# EasyEDA Pro project TOLL四合一电调.epro, board 100V_四路_功率板_HYG
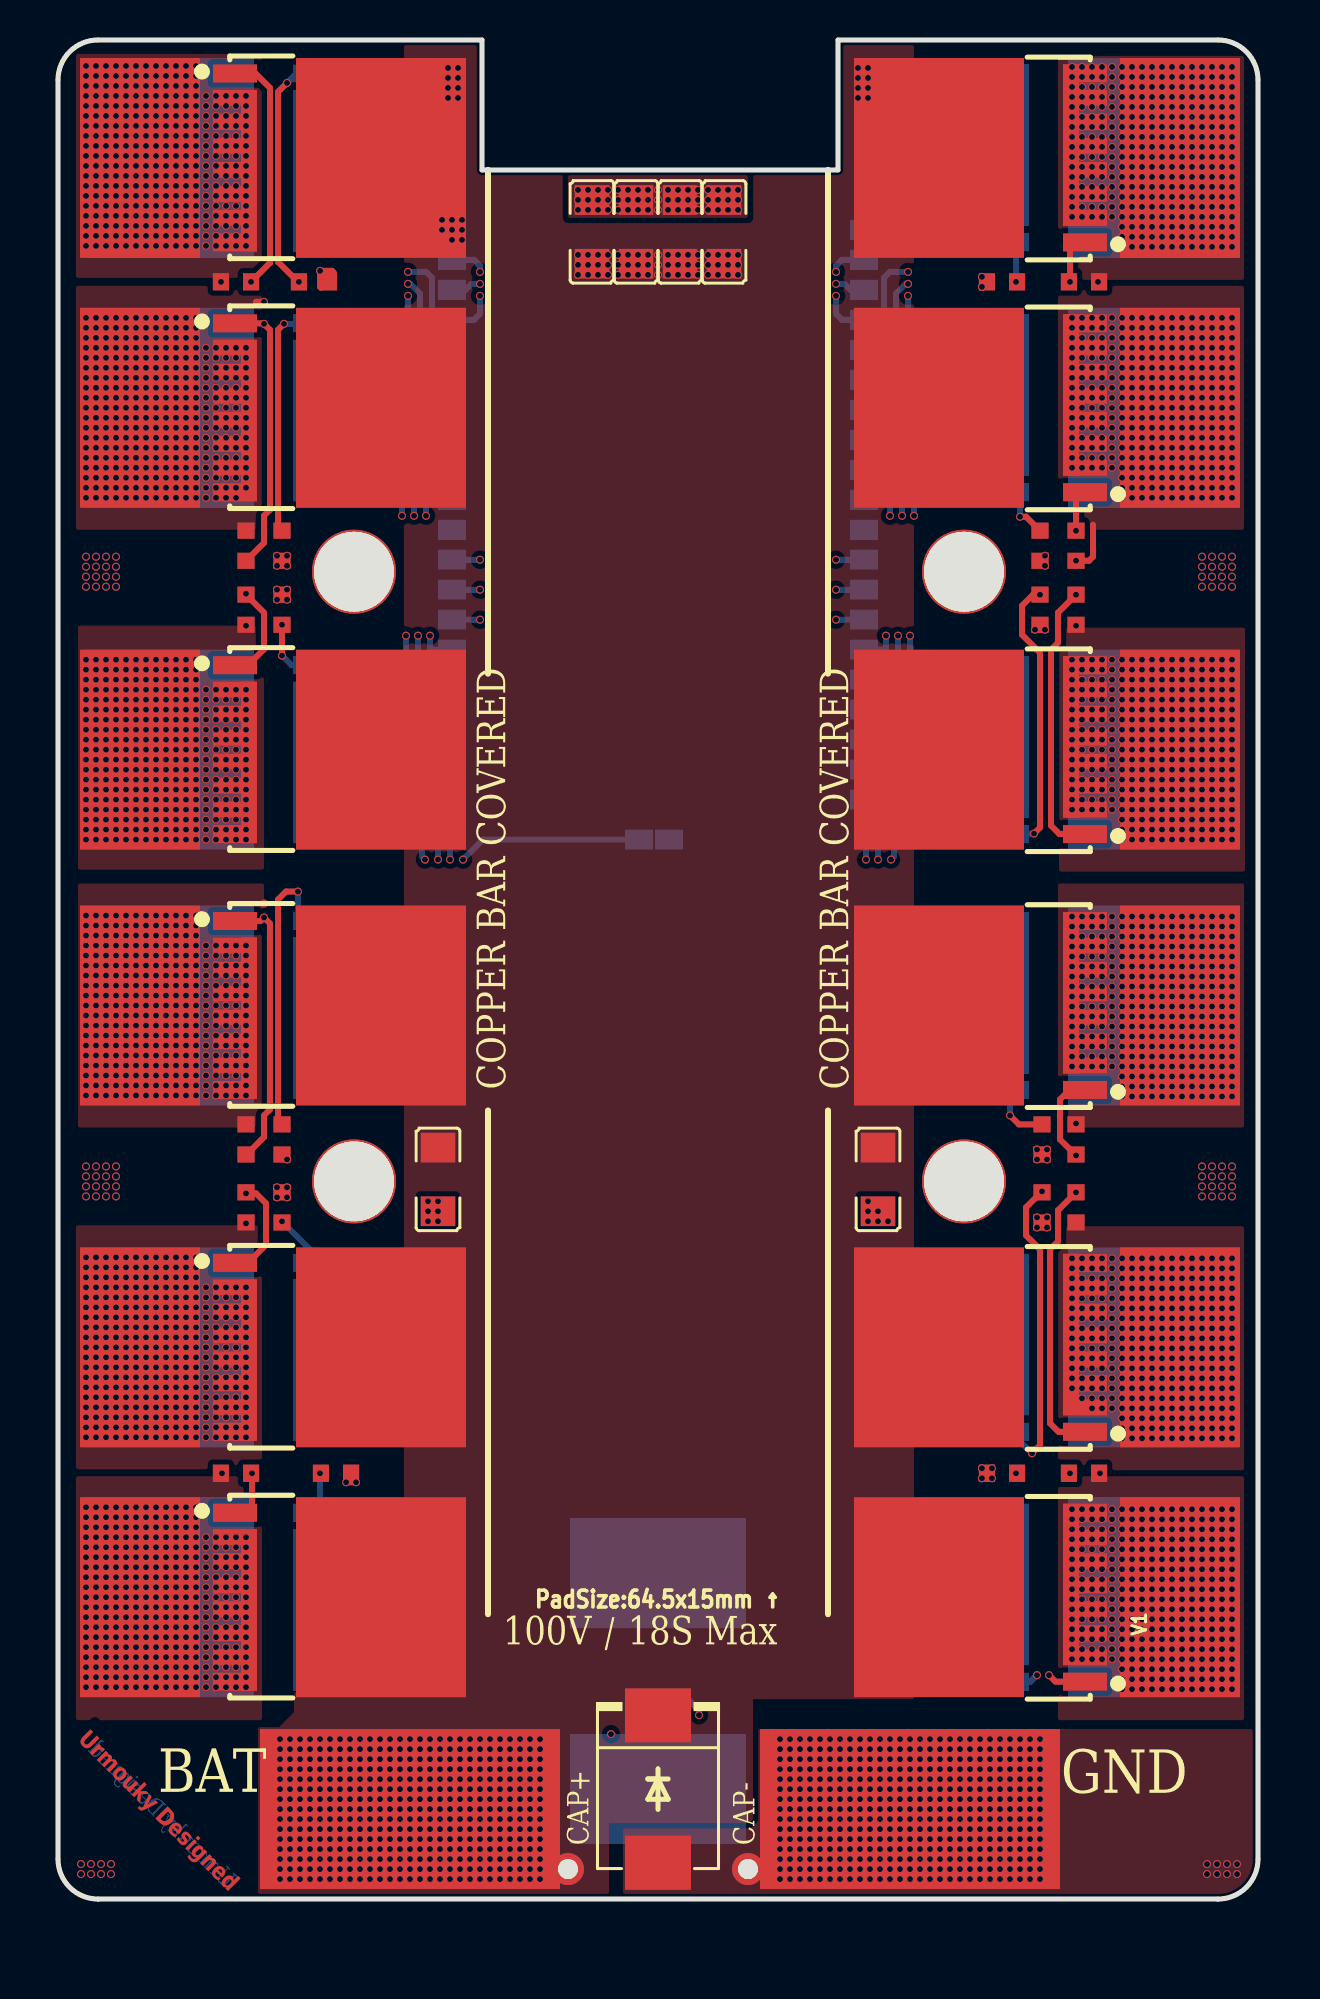
[diagram p1: board, top side]
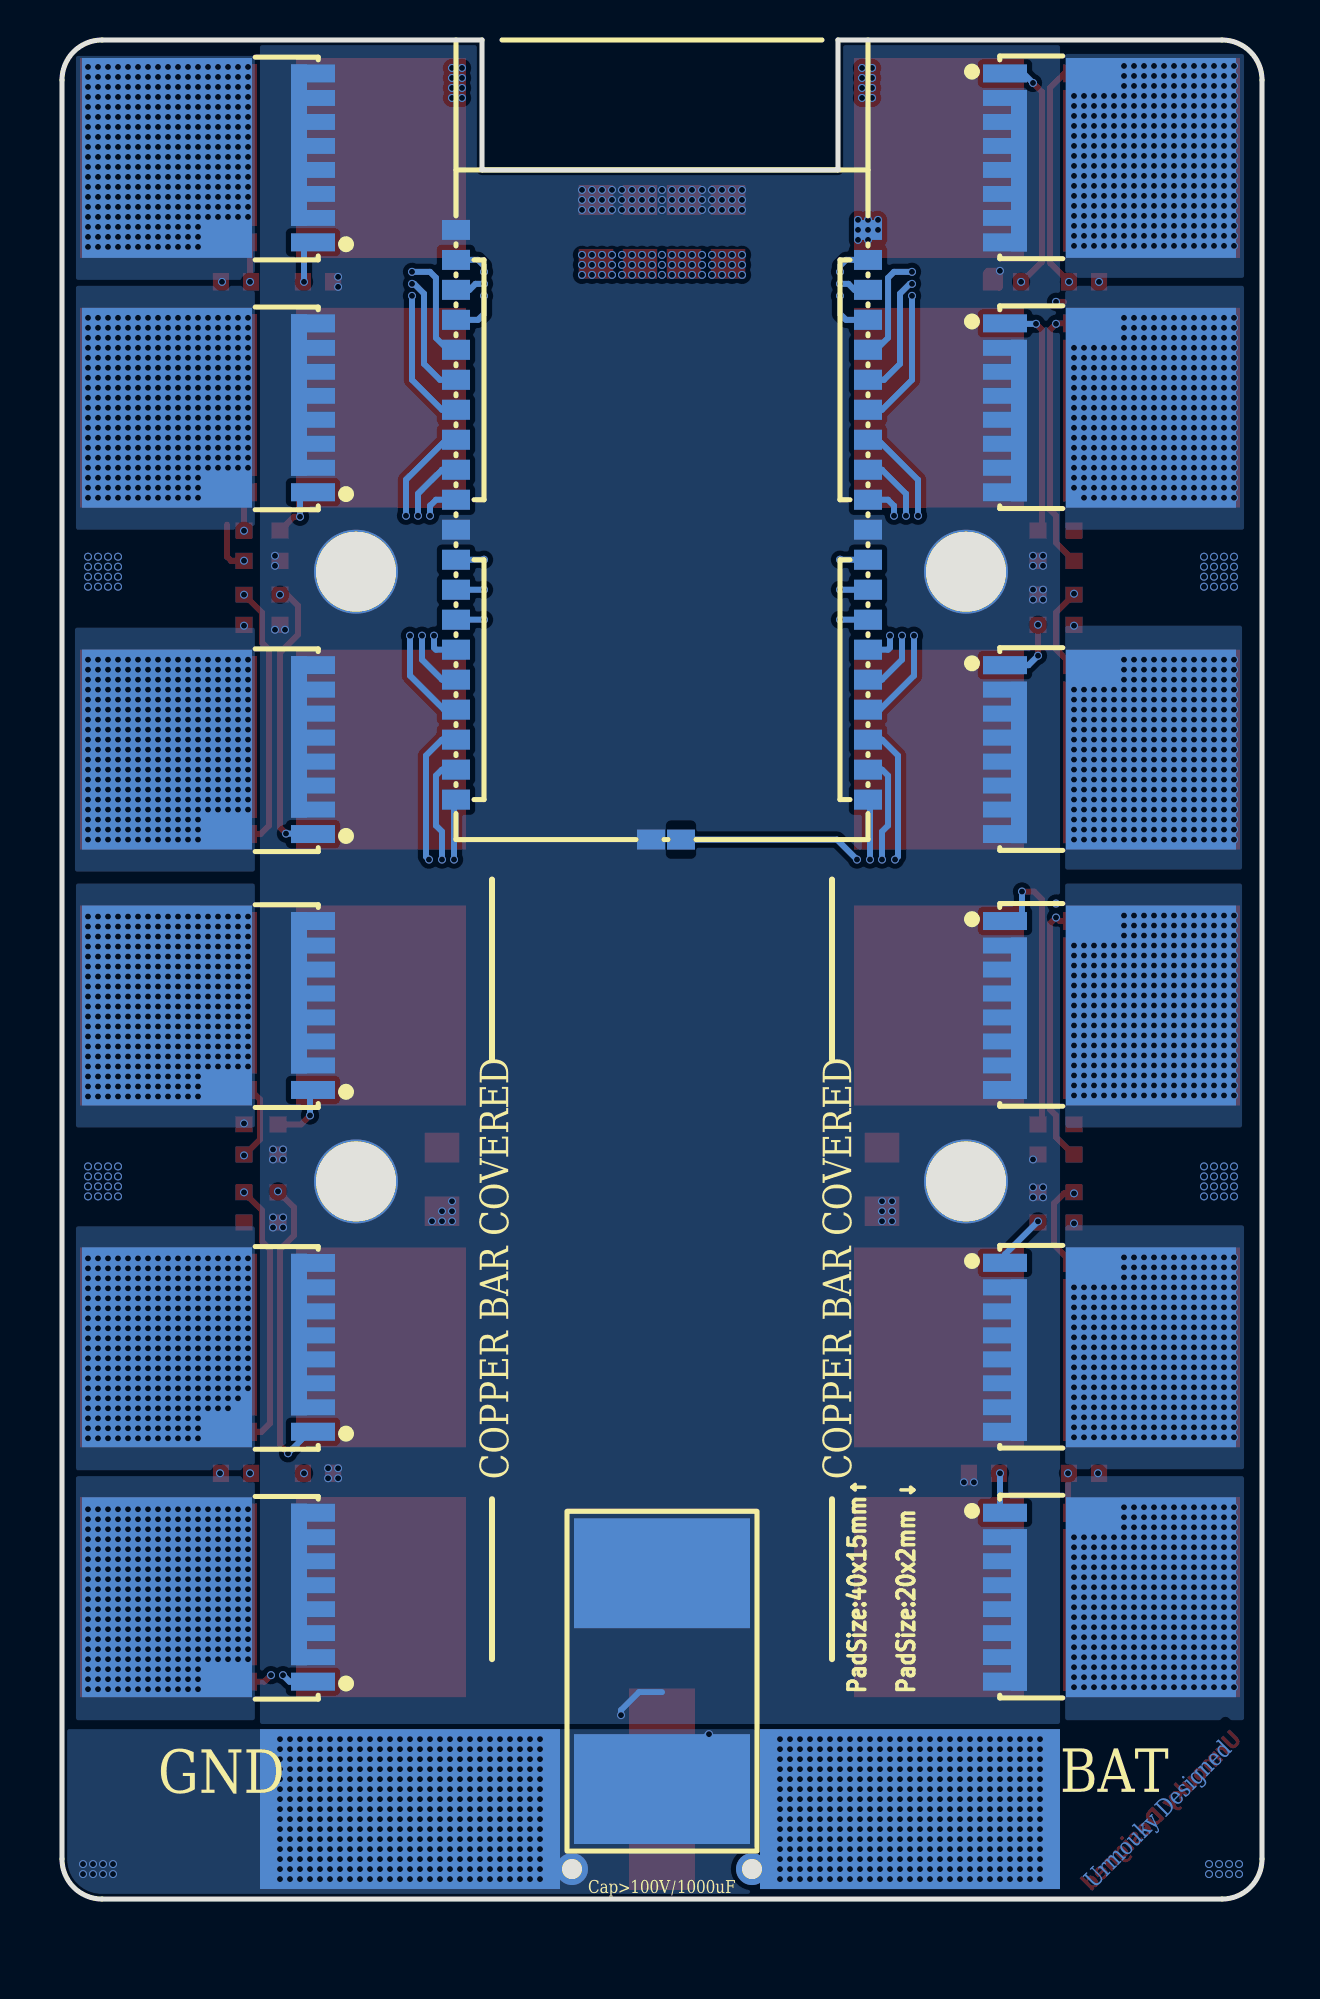
[diagram p2: board, bottom side, seen from below]

Outline 60 x 93 mm; copper layers: Top Layer, 过流源层, 隔离地层, 信号层, 过流地层, Bottom Layer. Coordinates in mm from the lower left corner of the outline.
Outline path: 0,91 arc(0.59,92.41) 2,93 21.2,93 21.2,86.5 39,86.5 39,93 58,93 arc(59.41,92.41) 60,91 60,2 arc(59.41,0.59) 58,0 2,0 arc(0.59,0.59) 0,2 0,91
Stack: Top Layer 0.035mm 外层铜厚1oz / Dielectric1 0.0994mm 3313 RC57% 4.2mil / 过流源层 0.0152mm 内层铜厚 / Dielectric2 0.55mm 0.55mm H/H No copper / 隔离地层 0.035mm / Dielectric3 0.1088mm 2116 RC54% 4.9mil / 信号层 0.035mm / Dielectric4 0.55mm 0.55mm H/H No copper / 过流地层 0.0152mm 内层铜厚 / Dielectric5 0.0994mm 3313 RC57% 4.2mil / Bottom Layer 0.035mm 外层铜厚1oz

## Design rules (mm)
template: 自定义配置
spacing copperThickness1oz (default): track to track 0.102, other pairs 0.152 to 0.3
spacing copperThickness2oz: track to track 0.203, other pairs 0.152 to 0.3
track width copperThickness1oz (default): min 0.127, default 0.254, max 2.54
track width copperThickness2oz: min 0.203, default 0.254, max 2.54
differential pair differentialPair (default): width min 0.127, default 0.254, max 2.54; gap min 0.152, default 0.152
via viaSize (default): diameter min 0.4, default 0.4, max 10; hole min 0.3, default 0.3, max 6.3

## Placement (name value [footprint] x y rotation side)
BAT  -  [焊盘3*4mm#2]  17.6 4.5 0 top
BAT1  -  [焊盘3*4mm#2]  17.6 4.5 180 bottom
Board1  -  [AT32四合一电调控制板]  30 73 180 bottom
C2  10uF  [C1206]  26.7 83.4 270 top
C3  10uF  [C1206]  19 36 90 top
C4  10uF  [C1206]  28.9 83.4 270 top
C5  10uF  [C1206]  31.1 83.4 270 top
C6  10uF  [C1206]  33.3 83.4 270 top
C7  10uF  [C1206]  41 36 90 top
D2  SMDJ90A  [SMC_L6.9-W5.9-LS8.0-RD]  30 5.5 270 top
GND  -  [焊盘3*4mm#2]  42.6 4.5 0 top
GND1  -  [焊盘3*4mm#2]  42.6 4.5 180 bottom
NOREF  -  [Pad_e244]  14.8 66.4 0 top
NOREF#2  -  [Pad_e19]  25.5 1.5 0 top
NOREF#3  -  [Pad_e248]  45.3 35.9 0 top
NOREF#4  -  [Pad_e18]  34.5 1.5 0 top
NOREF#5  -  [Pad_e246]  45.3 66.4 0 top
NOREF#6  -  [Pad_e247]  14.8 35.9 0 top
Q1  HYG015N10NS1TA  [TOLL-8_L10.4-W9.9-P1.20-LS11.7-BL]  47.7 27.6 90 top
Q2  HYG015N10NS1TA  [TOLL-8_L10.4-W9.9-P1.20-LS11.7-BL]  47.7 15.1 90 top
Q3  HYG015N10NS1TA  [TOLL-8_L10.4-W9.9-P1.20-LS11.7-BL]  47.7 44.7 90 top
Q4  HYG015N10NS1TA  [TOLL-8_L10.4-W9.9-P1.20-LS11.7-BL]  51.1 27.6 90 bottom
Q5  HYG015N10NS1TA  [TOLL-8_L10.4-W9.9-P1.20-LS11.7-BL]  51.1 15.1 90 bottom
Q6  HYG015N10NS1TA  [TOLL-8_L10.4-W9.9-P1.20-LS11.7-BL]  51.1 44.7 90 bottom
Q7  HYG015N10NS1TA  [TOLL-8_L10.4-W9.9-P1.20-LS11.7-BL]  47.7 57.5 90 top
Q8  HYG015N10NS1TA  [TOLL-8_L10.4-W9.9-P1.20-LS11.7-BL]  47.7 74.6 90 top
Q9  HYG015N10NS1TA  [TOLL-8_L10.4-W9.9-P1.20-LS11.7-BL]  47.7 87.1 90 top
Q10  HYG015N10NS1TA  [TOLL-8_L10.4-W9.9-P1.20-LS11.7-BL]  51.1 57.5 90 bottom
Q11  HYG015N10NS1TA  [TOLL-8_L10.4-W9.9-P1.20-LS11.7-BL]  51.1 74.6 90 bottom
Q12  HYG015N10NS1TA  [TOLL-8_L10.4-W9.9-P1.20-LS11.7-BL]  51.1 87.1 90 bottom
Q13  HYG015N10NS1TA  [TOLL-8_L10.4-W9.9-P1.20-LS11.7-BL]  12.5 44.7 270 top
Q14  HYG015N10NS1TA  [TOLL-8_L10.4-W9.9-P1.20-LS11.7-BL]  12.5 27.6 270 top
Q15  HYG015N10NS1TA  [TOLL-8_L10.4-W9.9-P1.20-LS11.7-BL]  12.5 15.1 270 top
Q16  HYG015N10NS1TA  [TOLL-8_L10.4-W9.9-P1.20-LS11.7-BL]  9.2 44.7 270 bottom
Q17  HYG015N10NS1TA  [TOLL-8_L10.4-W9.9-P1.20-LS11.7-BL]  9.2 27.6 270 bottom
Q18  HYG015N10NS1TA  [TOLL-8_L10.4-W9.9-P1.20-LS11.7-BL]  9.2 15.1 270 bottom
Q19  HYG015N10NS1TA  [TOLL-8_L10.4-W9.9-P1.20-LS11.7-BL]  12.5 87.1 270 top
Q20  HYG015N10NS1TA  [TOLL-8_L10.4-W9.9-P1.20-LS11.7-BL]  12.5 74.6 270 top
Q21  HYG015N10NS1TA  [TOLL-8_L10.4-W9.9-P1.20-LS11.7-BL]  12.5 57.5 270 top
Q22  HYG015N10NS1TA  [TOLL-8_L10.4-W9.9-P1.20-LS11.7-BL]  9.2 87.1 270 bottom
Q23  HYG015N10NS1TA  [TOLL-8_L10.4-W9.9-P1.20-LS11.7-BL]  9.2 74.6 270 bottom
Q24  HYG015N10NS1TA  [TOLL-8_L10.4-W9.9-P1.20-LS11.7-BL]  9.2 57.5 270 bottom
R1  10kΩ  [R0603]  50.9 34.6 270 top
R2  10kΩ  [R0603]  51.3 21.3 0 top
R3  10kΩ  [R0603]  50.9 38 90 top
R4  10kΩ  [R0603]  49.2 34.6 90 top
R5  10kΩ  [R0603]  47.2 21.3 0 top
R6  10kΩ  [R0603]  49.2 38 90 top
R7  10kΩ  [R0603]  50.9 64.5 270 top
R8  10kΩ  [R0603]  50.9 67.7 270 top
R9  10kΩ  [R0603]  51.3 80.9 0 top
R10  10kΩ  [R0603]  49.1 64.5 90 top
R11  10kΩ  [R0603]  49.1 67.7 90 top
R12  10kΩ  [R0603]  47.2 80.9 0 top
R13  10kΩ  [R0603]  9.4 38 90 top
R14  10kΩ  [R0603]  9.4 34.6 270 top
R15  10kΩ  [R0603]  8.9 21.3 180 top
R16  10kΩ  [R0603]  11.2 38 90 top
R17  10kΩ  [R0603]  11.2 34.6 270 top
R18  10kΩ  [R0603]  13.9 21.3 180 top
R19  10kΩ  [R0603]  8.9 80.9 180 top
R20  10kΩ  [R0603]  9.4 67.7 90 top
R21  10kΩ  [R0603]  9.4 64.5 270 top
R22  10kΩ  [R0603]  12.8 80.9 180 top
R23  10kΩ  [R0603]  11.2 67.7 90 top
R24  10kΩ  [R0603]  11.2 64.5 270 top
RSENS  0.2mΩ  [R5930]  30 10.9 90 bottom
U1  -  [焊盘3*4mm]  56.1 27.6 90 top
U2  -  [焊盘3*4mm]  56.1 57.5 90 top
U3  -  [焊盘3*4mm]  4.1 44.7 270 top
U4  -  [焊盘3*4mm]  4.1 87.1 270 top
V1  -  [焊盘3*4mm]  56.1 15.1 90 top
V2  -  [焊盘3*4mm]  56.1 74.6 90 top
V3  -  [焊盘3*4mm]  4.1 27.6 270 top
V4  -  [焊盘3*4mm]  4.1 74.6 270 top
W1  -  [焊盘3*4mm]  56.1 44.7 90 top
W2  -  [焊盘3*4mm]  56.1 87.1 90 top
W3  -  [焊盘3*4mm]  4.1 15.1 270 top
W4  -  [焊盘3*4mm]  4.1 57.5 270 top

## Footprints (pads in the part's own frame, mm; a bottom-side part is the same pattern mirrored in y, then rotated)
AT32四合一电调控制板
  custom 1.4x1 smd: 1(-10.3,10.5) 2(-10.3,9) 3(-10.3,7.5) 4(-10.3,6) 5(-10.3,4.5) 6(-10.3,3) 7(-10.3,1.5) 8(-10.3,0) 9(-10.3,-1.5) 10(-10.3,-3) 11(-10.3,-4.5) 12(-10.3,-6) 13(-10.3,-7.5) 14(-10.3,-9) 15(-10.3,-10.5) 16(-10.3,-12) 17(-10.3,-13.5) 18(-10.3,-15) 19(-10.3,-16.5) 20(-10.3,-18) 21(10.3,-18) 22(10.3,-16.5) 23(10.3,-15) 24(10.3,-13.5) 25(10.3,-12) 26(10.3,-10.5) 27(10.3,-9) 28(10.3,-7.5) 29(10.3,-6) 30(10.3,-4.5) 31(10.3,-3) 32(10.3,-1.5) 33(10.3,0) 34(10.3,1.5) 35(10.3,3) 36(10.3,4.5) 37(10.3,6) 38(10.3,7.5) 39(10.3,9) 40(10.3,10.5) 41(0.95,-20) 42(-0.55,-20)
C1206
  rect 1.485x1.728 smd: 1(-1.593,0) 2(1.593,0)
Pad_e18
  round 1.6 hole 1: 1(0,0)
Pad_e19
  round 1.6 hole 1: 1(0,0)
Pad_e244
  round 4.2 hole 4: 1(0,0)
Pad_e246
  round 4.2 hole 4: 1(0,0)
Pad_e247
  round 4.2 hole 4: 1(0,0)
Pad_e248
  round 4.2 hole 4: 1(0,0)
R0603
  rect 0.806x0.864 smd: 1(-0.753,0) 2(0.753,0)
R5930
  rect 5.5x8.8 smd: 1(-5.4,0) 2(5.4,0)
SMC_L6.9-W5.9-LS8.0-RD
  rect 2.7x3.3 smd: 1(-3.687,0) 2(3.687,0)
TOLL-8_L10.4-W9.9-P1.20-LS11.7-BL
  rect 0.9x2.2 smd: 1(-4.225,-3.65) 8(4.225,-3.65)
  rect 0.8x2.2 smd: 2(-3,-3.65) 3(-1.8,-3.65) 4(-0.6,-3.65) 5(0.6,-3.65) 6(1.8,-3.65) 7(3,-3.65)
  rect 8.08x0.8 smd: 8(0.64,-2.95)
  rect 10x8.5 smd: 9(0,3.65)
焊盘3*4mm
  rect 10x6 smd: 1(0,0)
焊盘3*4mm#2
  rect 15x8 smd: 1(0,0)

## Nets
As in the schematic, except:
GND: Board1.1 Board1.11 Board1.30 Board1.42 C2.1 C3.1 C4.1 C5.1 C6.1 C7.1 NOREF.1 NOREF#3.1 NOREF#5.1 NOREF#6.1 Q4.2 Q4.3 Q4.4 Q4.5 Q4.6 Q4.7 Q4.8 Q5.2 Q5.3 Q5.4 Q5.5 Q5.6 Q5.7 Q5.8 Q6.2 Q6.3 Q6.4 Q6.5 Q6.6 Q6.7 Q6.8 Q10.2 Q10.3 Q10.4 Q10.5 Q10.6 Q10.7 Q10.8 Q11.2 Q11.3 Q11.4 Q11.5 Q11.6 Q11.7 Q11.8 Q12.2 Q12.3 Q12.4 Q12.5 Q12.6 Q12.7 Q12.8 Q16.2 Q16.3 Q16.4 Q16.5 Q16.6 Q16.7 Q16.8 Q17.2 Q17.3 Q17.4 Q17.5 Q17.6 Q17.7 Q17.8 Q18.2 Q18.3 Q18.4 Q18.5 Q18.6 Q18.7 Q18.8 Q22.2 Q22.3 Q22.4 Q22.5 Q22.6 Q22.7 Q22.8 Q23.2 Q23.3 Q23.4 Q23.5 Q23.6 Q23.7 Q23.8 Q24.2 Q24.3 Q24.4 Q24.5 Q24.6 Q24.7 Q24.8 R4.1 R5.1 R6.1 R10.1 R11.1 R12.1 R16.1 R17.1 R18.1 R22.1 R23.1 R24.1 RSENS.2
GND_PORT: Board1.41 D2.2 GND.1 GND1.1 NOREF#4.1 RSENS.1
VIN_BOARD: BAT.1 BAT1.1 Board1.40 C2.2 C3.2 C4.2 C5.2 C6.2 C7.2 D2.1 NOREF#2.1 Q1.9 Q2.9 Q3.9 Q7.9 Q8.9 Q9.9 Q13.9 Q14.9 Q15.9 Q19.9 Q20.9 Q21.9

## Via types
v1: diameter 0.4, hole 0.3, Top Layer to Bottom Layer, 4834 vias

## Routing (per net, layer and track width the routed paths; a pad name or vN(x,y) marks a point on that pad's centre or on a via; arc(x,y) is an arc through that point)
GND: length 4.8
  Top Layer w0.3: v1(14.9,20.85) v1(14.4,20.85) ; 13.15,80.6 13.1,80.65 v1(13.1,81.45) 13.7,81.45 13.8,81.35
  Bottom Layer w0.3: 30,10.35 31.15,10.35 32.05,9.45 v1(32.05,9.2)
  vias: v1(1.15,1.75) v1(1.15,1.25) v1(1.4,67.15) v1(1.4,66.65) v1(1.4,66.15) v1(1.4,65.65) v1(1.4,36.65) v1(1.4,36.15) v1(1.4,35.65) v1(1.4,35.15) v1(1.65,1.75) v1(1.65,1.25) v1(1.9,67.15) v1(1.9,66.65) v1(1.9,66.15) v1(1.9,65.65) v1(1.9,36.65) v1(1.9,36.15) v1(1.9,35.65) v1(1.9,35.15) v1(2.15,1.75) v1(2.15,1.25) v1(2.4,67.15) v1(2.4,66.65) v1(2.4,66.15) v1(2.4,65.65) v1(2.4,36.65) v1(2.4,36.15) v1(2.4,35.65) v1(2.4,35.15) v1(2.65,1.75) v1(2.65,1.25) v1(2.9,67.15) v1(2.9,66.65) v1(2.9,66.15) v1(2.9,65.65) v1(2.9,36.65) v1(2.9,36.15) v1(2.9,35.65) v1(2.9,35.15) v1(10.95,67.2) v1(10.95,66.7) v1(10.95,65.5) v1(10.95,65) v1(10.95,35.6) v1(10.95,35.1) v1(11.45,67.2) v1(11.45,66.7) v1(11.45,65.5) v1(11.45,65) v1(11.45,37) v1(11.45,35.6) v1(11.45,35.1) v1(18.5,34.91) v1(18.5,34.41) v1(18.5,33.91) v1(19,34.91) v1(19,34.41) v1(19,33.91) v1(26,85.5) v1(26,85) v1(26,84.5) v1(26.5,85.5) v1(26.5,85) v1(26.5,84.5) v1(27,85.5) v1(27,85) v1(27,84.5) v1(27.5,85.5) v1(27.5,85) v1(27.5,84.5) v1(28,85.5) v1(28,85) v1(28,84.5) v1(28.5,85.5) v1(28.5,85) v1(28.5,84.5) v1(29,85.5) v1(29,85) v1(29,84.5) v1(29.5,85.5) v1(29.5,85) v1(29.5,84.5) v1(30,85.5) v1(30,85) v1(30,84.5) v1(30.5,85.5) v1(30.5,85) v1(30.5,84.5) v1(31,85.5) v1(31,85) v1(31,84.5) v1(31.5,85.5) v1(31.5,85) v1(31.5,84.5) v1(32,85.5) v1(32,85) v1(32,84.5) v1(32.5,85.5) v1(32.5,85) v1(32.5,84.5) v1(33,85.5) v1(33,85) v1(33,84.5) v1(33.5,85.5) v1(33.5,85) v1(33.5,84.5) v1(34,85.5) v1(34,85) v1(34,84.5) v1(40.5,34.91) v1(40.5,34.41) v1(40.5,33.91) v1(41,34.41) v1(41,33.91) v1(41.5,33.91) v1(46.2,81.15) v1(46.2,80.65) v1(46.2,21.55) v1(46.2,21.05) v1(46.7,21.55) v1(46.7,21.05) v1(48.85,63.5) v1(48.95,37.5) v1(48.95,37) v1(48.95,34.1) v1(48.95,33.6) v1(49.35,67.2) v1(49.35,66.7) v1(49.35,63.5) v1(49.45,37.5) v1(49.45,37) v1(49.45,34.1) v1(49.45,33.6) v1(57.2,67.15) v1(57.2,66.65) v1(57.2,66.15) v1(57.2,65.65) v1(57.2,36.65) v1(57.2,36.15) v1(57.2,35.65) v1(57.2,35.15) v1(57.7,67.15) v1(57.7,66.65) v1(57.7,66.15) v1(57.7,65.65) v1(57.7,36.65) v1(57.7,36.15) v1(57.7,35.65) v1(57.7,35.15) v1(58.2,67.15) v1(58.2,66.65) v1(58.2,66.15) v1(58.2,65.65) v1(58.2,36.65) v1(58.2,36.15) v1(58.2,35.65) v1(58.2,35.15) v1(58.7,67.15) v1(58.7,66.65) v1(58.7,66.15) v1(58.7,65.65) v1(58.7,36.65) v1(58.7,36.15) v1(58.7,35.65) v1(58.7,35.15)
GND_PORT: length 62.2
  信号层 w0.3: v1(20.25,52) 20.25,9.95 21.35,8.85 27.05,8.85 v1(27.65,8.25)
  Bottom Layer w0.3: v1(27.65,8.25) 27.7,8.25 28.8,7.15 30,7.15 ; v1(20.25,52) 21.25,53 Board1.41
  vias: v1(36.1,8) v1(36.1,7.5) v1(36.1,7) v1(36.1,6.5) v1(36.1,6) v1(36.1,5.5) v1(36.1,5) v1(36.1,4.5) v1(36.1,4) v1(36.1,3.5) v1(36.1,3) v1(36.1,2.5) v1(36.1,2) v1(36.1,1.5) v1(36.1,1) v1(36.6,8) v1(36.6,7.5) v1(36.6,7) v1(36.6,6.5) v1(36.6,6) v1(36.6,5.5) v1(36.6,5) v1(36.6,4.5) v1(36.6,4) v1(36.6,3.5) v1(36.6,3) v1(36.6,2.5) v1(36.6,2) v1(36.6,1.5) v1(36.6,1) v1(37.1,8) v1(37.1,7.5) v1(37.1,7) v1(37.1,6.5) v1(37.1,6) v1(37.1,5.5) v1(37.1,5) v1(37.1,4.5) v1(37.1,4) v1(37.1,3.5) v1(37.1,3) v1(37.1,2.5) v1(37.1,2) v1(37.1,1.5) v1(37.1,1) v1(37.6,8) v1(37.6,7.5) v1(37.6,7) v1(37.6,6.5) v1(37.6,6) v1(37.6,5.5) v1(37.6,5) v1(37.6,4.5) v1(37.6,4) v1(37.6,3.5) v1(37.6,3) v1(37.6,2.5) v1(37.6,2) v1(37.6,1.5) v1(37.6,1) v1(38.1,8) v1(38.1,7.5) v1(38.1,7) v1(38.1,6.5) v1(38.1,6) v1(38.1,5.5) v1(38.1,5) v1(38.1,4.5) v1(38.1,4) v1(38.1,3.5) v1(38.1,3) v1(38.1,2.5) v1(38.1,2) v1(38.1,1.5) v1(38.1,1) v1(38.6,8) v1(38.6,7.5) v1(38.6,7) v1(38.6,6.5) v1(38.6,6) v1(38.6,5.5) v1(38.6,5) v1(38.6,4.5) v1(38.6,4) v1(38.6,3.5) v1(38.6,3) v1(38.6,2.5) v1(38.6,2) v1(38.6,1.5) v1(38.6,1) v1(39.1,8) v1(39.1,7.5) v1(39.1,7) v1(39.1,6.5) v1(39.1,6) v1(39.1,5.5) v1(39.1,5) v1(39.1,4.5) v1(39.1,4) v1(39.1,3.5) v1(39.1,3) v1(39.1,2.5) v1(39.1,2) v1(39.1,1.5) v1(39.1,1) v1(39.6,8) v1(39.6,7.5) v1(39.6,7) v1(39.6,6.5) v1(39.6,6) v1(39.6,5.5) v1(39.6,5) v1(39.6,4.5) v1(39.6,4) v1(39.6,3.5) v1(39.6,3) v1(39.6,2.5) v1(39.6,2) v1(39.6,1.5) v1(39.6,1) v1(40.1,8) v1(40.1,7.5) v1(40.1,7) v1(40.1,6.5) v1(40.1,6) v1(40.1,5.5) v1(40.1,5) v1(40.1,4.5) v1(40.1,4) v1(40.1,3.5) v1(40.1,3) v1(40.1,2.5) v1(40.1,2) v1(40.1,1.5) v1(40.1,1) v1(40.6,8) v1(40.6,7.5) v1(40.6,7) v1(40.6,6.5) v1(40.6,6) v1(40.6,5.5) v1(40.6,5) v1(40.6,4.5) v1(40.6,4) v1(40.6,3.5) v1(40.6,3) v1(40.6,2.5) v1(40.6,2) v1(40.6,1.5) v1(40.6,1) v1(41.1,8) v1(41.1,7.5) v1(41.1,7) v1(41.1,6.5) v1(41.1,6) v1(41.1,5.5) v1(41.1,5) v1(41.1,4.5) v1(41.1,4) v1(41.1,3.5) v1(41.1,3) v1(41.1,2.5) v1(41.1,2) v1(41.1,1.5) v1(41.1,1) v1(41.6,8) v1(41.6,7.5) v1(41.6,7) v1(41.6,6.5) v1(41.6,6) v1(41.6,5.5) v1(41.6,5) v1(41.6,4.5) v1(41.6,4) v1(41.6,3.5) v1(41.6,3) v1(41.6,2.5) v1(41.6,2) v1(41.6,1.5) v1(41.6,1) v1(42.1,8) v1(42.1,7.5) v1(42.1,7) v1(42.1,6.5) v1(42.1,6) v1(42.1,5.5) v1(42.1,5) v1(42.1,4.5) v1(42.1,4) v1(42.1,3.5) v1(42.1,3) v1(42.1,2.5) v1(42.1,2) v1(42.1,1.5) v1(42.1,1) v1(42.6,8) v1(42.6,7.5) v1(42.6,7) v1(42.6,6.5) v1(42.6,6) v1(42.6,5.5) v1(42.6,5) v1(42.6,4.5) v1(42.6,4) v1(42.6,3.5) v1(42.6,3) v1(42.6,2.5) v1(42.6,2) v1(42.6,1.5) v1(42.6,1) v1(43.1,8) v1(43.1,7.5) v1(43.1,7) v1(43.1,6.5) v1(43.1,6) v1(43.1,5.5) v1(43.1,5) v1(43.1,4.5) v1(43.1,4) v1(43.1,3.5) v1(43.1,3) v1(43.1,2.5) v1(43.1,2) v1(43.1,1.5) v1(43.1,1) v1(43.6,8) v1(43.6,7.5) v1(43.6,7) v1(43.6,6.5) v1(43.6,6) v1(43.6,5.5) v1(43.6,5) v1(43.6,4.5) v1(43.6,4) v1(43.6,3.5) v1(43.6,3) v1(43.6,2.5) v1(43.6,2) v1(43.6,1.5) v1(43.6,1) v1(44.1,8) v1(44.1,7.5) v1(44.1,7) v1(44.1,6.5) v1(44.1,6) v1(44.1,5.5) v1(44.1,5) v1(44.1,4.5) v1(44.1,4) v1(44.1,3.5) v1(44.1,3) v1(44.1,2.5) v1(44.1,2) v1(44.1,1.5) v1(44.1,1) v1(44.6,8) v1(44.6,7.5) v1(44.6,7) v1(44.6,6.5) v1(44.6,6) v1(44.6,5.5) v1(44.6,5) v1(44.6,4.5) v1(44.6,4) v1(44.6,3.5) v1(44.6,3) v1(44.6,2.5) v1(44.6,2) v1(44.6,1.5) v1(44.6,1) v1(45.1,8) v1(45.1,7.5) v1(45.1,7) v1(45.1,6.5) v1(45.1,6) v1(45.1,5.5) v1(45.1,5) v1(45.1,4.5) v1(45.1,4) v1(45.1,3.5) v1(45.1,3) v1(45.1,2.5) v1(45.1,2) v1(45.1,1.5) v1(45.1,1) v1(45.6,8) v1(45.6,7.5) v1(45.6,7) v1(45.6,6.5) v1(45.6,6) v1(45.6,5.5) v1(45.6,5) v1(45.6,4.5) v1(45.6,4) v1(45.6,3.5) v1(45.6,3) v1(45.6,2.5) v1(45.6,2) v1(45.6,1.5) v1(45.6,1) v1(46.1,8) v1(46.1,7.5) v1(46.1,7) v1(46.1,6.5) v1(46.1,6) v1(46.1,5.5) v1(46.1,5) v1(46.1,4.5) v1(46.1,4) v1(46.1,3.5) v1(46.1,3) v1(46.1,2.5) v1(46.1,2) v1(46.1,1.5) v1(46.1,1) v1(46.6,8) v1(46.6,7.5) v1(46.6,7) v1(46.6,6.5) v1(46.6,6) v1(46.6,5.5) v1(46.6,5) v1(46.6,4.5) v1(46.6,4) v1(46.6,3.5) v1(46.6,3) v1(46.6,2.5) v1(46.6,2) v1(46.6,1.5) v1(46.6,1) v1(47.1,8) v1(47.1,7.5) v1(47.1,7) v1(47.1,6.5) v1(47.1,6) v1(47.1,5.5) v1(47.1,5) v1(47.1,4.5) v1(47.1,4) v1(47.1,3.5) v1(47.1,3) v1(47.1,2.5) v1(47.1,2) v1(47.1,1.5) v1(47.1,1) v1(47.6,8) v1(47.6,7.5) v1(47.6,7) v1(47.6,6.5) v1(47.6,6) v1(47.6,5.5) v1(47.6,5) v1(47.6,4.5) v1(47.6,4) v1(47.6,3.5) v1(47.6,3) v1(47.6,2.5) v1(47.6,2) v1(47.6,1.5) v1(47.6,1) v1(48.1,8) v1(48.1,7.5) v1(48.1,7) v1(48.1,6.5) v1(48.1,6) v1(48.1,5.5) v1(48.1,5) v1(48.1,4.5) v1(48.1,4) v1(48.1,3.5) v1(48.1,3) v1(48.1,2.5) v1(48.1,2) v1(48.1,1.5) v1(48.1,1) v1(48.6,8) v1(48.6,7.5) v1(48.6,7) v1(48.6,6.5) v1(48.6,6) v1(48.6,5.5) v1(48.6,5) v1(48.6,4.5) v1(48.6,4) v1(48.6,3.5) v1(48.6,3) v1(48.6,2.5) v1(48.6,2) v1(48.6,1.5) v1(48.6,1) v1(49.1,8) v1(49.1,7.5) v1(49.1,7) v1(49.1,6.5) v1(49.1,6) v1(49.1,5.5) v1(49.1,5) v1(49.1,4.5) v1(49.1,4) v1(49.1,3.5) v1(49.1,3) v1(49.1,2.5) v1(49.1,2) v1(49.1,1.5) v1(49.1,1) v1(57.45,1.75) v1(57.45,1.25) v1(57.95,1.75) v1(57.95,1.25) v1(58.45,1.75) v1(58.45,1.25) v1(58.95,1.75) v1(58.95,1.25)
VIN_BOARD:
  vias: v1(11.1,8) v1(11.1,7.5) v1(11.1,7) v1(11.1,6.5) v1(11.1,6) v1(11.1,5.5) v1(11.1,5) v1(11.1,4.5) v1(11.1,4) v1(11.1,3.5) v1(11.1,3) v1(11.1,2.5) v1(11.1,2) v1(11.1,1.5) v1(11.1,1) v1(11.6,8) v1(11.6,7.5) v1(11.6,7) v1(11.6,6.5) v1(11.6,6) v1(11.6,5.5) v1(11.6,5) v1(11.6,4.5) v1(11.6,4) v1(11.6,3.5) v1(11.6,3) v1(11.6,2.5) v1(11.6,2) v1(11.6,1.5) v1(11.6,1) v1(12.1,8) v1(12.1,7.5) v1(12.1,7) v1(12.1,6.5) v1(12.1,6) v1(12.1,5.5) v1(12.1,5) v1(12.1,4.5) v1(12.1,4) v1(12.1,3.5) v1(12.1,3) v1(12.1,2.5) v1(12.1,2) v1(12.1,1.5) v1(12.1,1) v1(12.6,8) v1(12.6,7.5) v1(12.6,7) v1(12.6,6.5) v1(12.6,6) v1(12.6,5.5) v1(12.6,5) v1(12.6,4.5) v1(12.6,4) v1(12.6,3.5) v1(12.6,3) v1(12.6,2.5) v1(12.6,2) v1(12.6,1.5) v1(12.6,1) v1(13.1,8) v1(13.1,7.5) v1(13.1,7) v1(13.1,6.5) v1(13.1,6) v1(13.1,5.5) v1(13.1,5) v1(13.1,4.5) v1(13.1,4) v1(13.1,3.5) v1(13.1,3) v1(13.1,2.5) v1(13.1,2) v1(13.1,1.5) v1(13.1,1) v1(13.6,8) v1(13.6,7.5) v1(13.6,7) v1(13.6,6.5) v1(13.6,6) v1(13.6,5.5) v1(13.6,5) v1(13.6,4.5) v1(13.6,4) v1(13.6,3.5) v1(13.6,3) v1(13.6,2.5) v1(13.6,2) v1(13.6,1.5) v1(13.6,1) v1(14.1,8) v1(14.1,7.5) v1(14.1,7) v1(14.1,6.5) v1(14.1,6) v1(14.1,5.5) v1(14.1,5) v1(14.1,4.5) v1(14.1,4) v1(14.1,3.5) v1(14.1,3) v1(14.1,2.5) v1(14.1,2) v1(14.1,1.5) v1(14.1,1) v1(14.6,8) v1(14.6,7.5) v1(14.6,7) v1(14.6,6.5) v1(14.6,6) v1(14.6,5.5) v1(14.6,5) v1(14.6,4.5) v1(14.6,4) v1(14.6,3.5) v1(14.6,3) v1(14.6,2.5) v1(14.6,2) v1(14.6,1.5) v1(14.6,1) v1(15.1,8) v1(15.1,7.5) v1(15.1,7) v1(15.1,6.5) v1(15.1,6) v1(15.1,5.5) v1(15.1,5) v1(15.1,4.5) v1(15.1,4) v1(15.1,3.5) v1(15.1,3) v1(15.1,2.5) v1(15.1,2) v1(15.1,1.5) v1(15.1,1) v1(15.6,8) v1(15.6,7.5) v1(15.6,7) v1(15.6,6.5) v1(15.6,6) v1(15.6,5.5) v1(15.6,5) v1(15.6,4.5) v1(15.6,4) v1(15.6,3.5) v1(15.6,3) v1(15.6,2.5) v1(15.6,2) v1(15.6,1.5) v1(15.6,1) v1(16.1,8) v1(16.1,7.5) v1(16.1,7) v1(16.1,6.5) v1(16.1,6) v1(16.1,5.5) v1(16.1,5) v1(16.1,4.5) v1(16.1,4) v1(16.1,3.5) v1(16.1,3) v1(16.1,2.5) v1(16.1,2) v1(16.1,1.5) v1(16.1,1) v1(16.6,8) v1(16.6,7.5) v1(16.6,7) v1(16.6,6.5) v1(16.6,6) v1(16.6,5.5) v1(16.6,5) v1(16.6,4.5) v1(16.6,4) v1(16.6,3.5) v1(16.6,3) v1(16.6,2.5) v1(16.6,2) v1(16.6,1.5) v1(16.6,1) v1(17.1,8) v1(17.1,7.5) v1(17.1,7) v1(17.1,6.5) v1(17.1,6) v1(17.1,5.5) v1(17.1,5) v1(17.1,4.5) v1(17.1,4) v1(17.1,3.5) v1(17.1,3) v1(17.1,2.5) v1(17.1,2) v1(17.1,1.5) v1(17.1,1) v1(17.6,8) v1(17.6,7.5) v1(17.6,7) v1(17.6,6.5) v1(17.6,6) v1(17.6,5.5) v1(17.6,5) v1(17.6,4.5) v1(17.6,4) v1(17.6,3.5) v1(17.6,3) v1(17.6,2.5) v1(17.6,2) v1(17.6,1.5) v1(17.6,1) v1(18.1,8) v1(18.1,7.5) v1(18.1,7) v1(18.1,6.5) v1(18.1,6) v1(18.1,5.5) v1(18.1,5) v1(18.1,4.5) v1(18.1,4) v1(18.1,3.5) v1(18.1,3) v1(18.1,2.5) v1(18.1,2) v1(18.1,1.5) v1(18.1,1) v1(18.6,8) v1(18.6,7.5) v1(18.6,7) v1(18.6,6.5) v1(18.6,6) v1(18.6,5.5) v1(18.6,5) v1(18.6,4.5) v1(18.6,4) v1(18.6,3.5) v1(18.6,3) v1(18.6,2.5) v1(18.6,2) v1(18.6,1.5) v1(18.6,1) v1(19.1,8) v1(19.1,7.5) v1(19.1,7) v1(19.1,6.5) v1(19.1,6) v1(19.1,5.5) v1(19.1,5) v1(19.1,4.5) v1(19.1,4) v1(19.1,3.5) v1(19.1,3) v1(19.1,2.5) v1(19.1,2) v1(19.1,1.5) v1(19.1,1) v1(19.2,84) v1(19.2,83.5) v1(19.5,91.6) v1(19.5,91.1) v1(19.5,90.6) v1(19.5,90.1) v1(19.6,8) v1(19.6,7.5) v1(19.6,7) v1(19.6,6.5) v1(19.6,6) v1(19.6,5.5) v1(19.6,5) v1(19.6,4.5) v1(19.6,4) v1(19.6,3.5) v1(19.6,3) v1(19.6,2.5) v1(19.6,2) v1(19.6,1.5) v1(19.6,1) v1(19.7,84) v1(19.7,83.5) v1(19.7,83) v1(20,91.6) v1(20,91.1) v1(20,90.6) v1(20,90.1) v1(20.1,8) v1(20.1,7.5) v1(20.1,7) v1(20.1,6.5) v1(20.1,6) v1(20.1,5.5) v1(20.1,5) v1(20.1,4.5) v1(20.1,4) v1(20.1,3.5) v1(20.1,3) v1(20.1,2.5) v1(20.1,2) v1(20.1,1.5) v1(20.1,1) v1(20.2,84) v1(20.2,83.5) v1(20.2,83) v1(20.6,8) v1(20.6,7.5) v1(20.6,7) v1(20.6,6.5) v1(20.6,6) v1(20.6,5.5) v1(20.6,5) v1(20.6,4.5) v1(20.6,4) v1(20.6,3.5) v1(20.6,3) v1(20.6,2.5) v1(20.6,2) v1(20.6,1.5) v1(20.6,1) v1(21.1,8) v1(21.1,7.5) v1(21.1,7) v1(21.1,6.5) v1(21.1,6) v1(21.1,5.5) v1(21.1,5) v1(21.1,4.5) v1(21.1,4) v1(21.1,3.5) v1(21.1,3) v1(21.1,2.5) v1(21.1,2) v1(21.1,1.5) v1(21.1,1) v1(21.6,8) v1(21.6,7.5) v1(21.6,7) v1(21.6,6.5) v1(21.6,6) v1(21.6,5.5) v1(21.6,5) v1(21.6,4.5) v1(21.6,4) v1(21.6,3.5) v1(21.6,3) v1(21.6,2.5) v1(21.6,2) v1(21.6,1.5) v1(21.6,1) v1(22.1,8) v1(22.1,7.5) v1(22.1,7) v1(22.1,6.5) v1(22.1,6) v1(22.1,5.5) v1(22.1,5) v1(22.1,4.5) v1(22.1,4) v1(22.1,3.5) v1(22.1,3) v1(22.1,2.5) v1(22.1,2) v1(22.1,1.5) v1(22.1,1) v1(22.6,8) v1(22.6,7.5) v1(22.6,7) v1(22.6,6.5) v1(22.6,6) v1(22.6,5.5) v1(22.6,5) v1(22.6,4.5) v1(22.6,4) v1(22.6,3.5) v1(22.6,3) v1(22.6,2.5) v1(22.6,2) v1(22.6,1.5) v1(22.6,1) v1(23.1,8) v1(23.1,7.5) v1(23.1,7) v1(23.1,6.5) v1(23.1,6) v1(23.1,5.5) v1(23.1,5) v1(23.1,4.5) v1(23.1,4) v1(23.1,3.5) v1(23.1,3) v1(23.1,2.5) v1(23.1,2) v1(23.1,1.5) v1(23.1,1) v1(23.6,8) v1(23.6,7.5) v1(23.6,7) v1(23.6,6.5) v1(23.6,6) v1(23.6,5.5) v1(23.6,5) v1(23.6,4.5) v1(23.6,4) v1(23.6,3.5) v1(23.6,3) v1(23.6,2.5) v1(23.6,2) v1(23.6,1.5) v1(23.6,1) v1(24.1,8) v1(24.1,7.5) v1(24.1,7) v1(24.1,6.5) v1(24.1,6) v1(24.1,5.5) v1(24.1,5) v1(24.1,4.5) v1(24.1,4) v1(24.1,3.5) v1(24.1,3) v1(24.1,2.5) v1(24.1,2) v1(24.1,1.5) v1(24.1,1) v1(26,82.25) v1(26,81.75) v1(26,81.25) v1(26.5,82.25) v1(26.5,81.75) v1(26.5,81.25) v1(27,82.25) v1(27,81.75) v1(27,81.25) v1(27.5,82.25) v1(27.5,81.75) v1(27.5,81.25) v1(28,82.25) v1(28,81.75) v1(28,81.25) v1(28.5,82.25) v1(28.5,81.75) v1(28.5,81.25) v1(29,82.25) v1(29,81.75) v1(29,81.25) v1(29.5,82.25) v1(29.5,81.75) v1(29.5,81.25) v1(30,82.25) v1(30,81.75) v1(30,81.25) v1(30.5,82.25) v1(30.5,81.75) v1(30.5,81.25) v1(31,82.25) v1(31,81.75) v1(31,81.25) v1(31.5,82.25) v1(31.5,81.75) v1(31.5,81.25) v1(32,82.25) v1(32,81.75) v1(32,81.25) v1(32.5,82.25) v1(32.5,81.75) v1(32.5,81.25) v1(33,82.25) v1(33,81.75) v1(33,81.25) v1(33.5,82.25) v1(33.5,81.75) v1(33.5,81.25) v1(34,82.25) v1(34,81.75) v1(34,81.25) v1(40,91.6) v1(40,91.1) v1(40,90.6) v1(40,90.1) v1(40.5,91.6) v1(40.5,91.1) v1(40.5,90.6) v1(40.5,90.1)
M1GHU: length 47.1
  Top Layer w0.3: Q1.1 50.02,23.37 49.6,23.8 49.6,32.5 50,32.9 50,34.45 v1(50.9,35.35)
  信号层 w0.3: 50.9,35.3 50,35.3 49.3,34.6 48.3,34.6 47,33.3 44,33.3 41,36.3 v1(41,52)
  Bottom Layer w0.3: Board1.19 41,56.5 41.3,56.2 41.3,53.7 41,53.4 v1(41,52)
M1GHV: length 63.6
  Top Layer w0.3: v1(49.55,11.2) 49.87,10.88 Q2.1
  信号层 w0.3: v1(49.55,11.2) 49.55,20.25 v1(50.6,21.3) 39.2,32.7 39.2,53.3 42,56.1 v1(42,63.2)
  Bottom Layer w0.3: Board1.16 41,61 42,62 v1(42,63.2)
M1GHW: length 41.7
  Top Layer w0.3: v1(50.9,37.2) 50.1,38 50.1,40 50.58,40.47 Q3.1
  信号层 w0.3: v1(50.9,37.2) 50,38.1 47.9,38.1 47,39 47,59.51 41.01,65.5 v1(38.9,65.5)
  Bottom Layer w0.3: Board1.13 v1(38.9,65.5)
M1GLU: length 42.4
  Top Layer w0.3: v1(48.7,22.3) 49.1,22.7 49.1,32.5 48.4,33.2 48.4,34.6 v1(49.2,35.4)
  信号层 w0.3: v1(41.65,52) 41.65,43.45 49.2,35.9 v1(49.2,35.4)
  Bottom Layer w0.3: v1(41.65,52) 41.8,52.15 41.8,57.2 41,58 Board1.18 ; v1(48.7,22.3) 47.62,23.37 Q4.1
M1GLV: length 60.8
  信号层 w0.3: v1(41.4,63.2) 41.4,56.4 38.6,53.6 38.6,32.4 47.9,23.1 v1(47.9,21.3) 48.95,20.25 v1(48.95,11.2)
  Bottom Layer w0.3: Q5.1 48.62,10.88 v1(48.95,11.2) ; Board1.15 41.3,62.5 41.4,62.6 v1(41.4,63.2)
M1GLW: length 36.7
  Top Layer w0.3: R6.2 48.05,38.75 v1(47.6,39.2)
  信号层 w0.3: v1(38.9,67) Board1.12 47.6,59.7 v1(47.6,39.2)
  Bottom Layer w0.3: Board1.12 v1(38.9,67) ; Q6.1 47.6,40.32 v1(47.6,39.2)
M1OUTU: length 30.9
  信号层 w0.3: v1(40.4,52) 40.4,36.1 43.8,32.7 50.05,32.7 v1(50.7,32.05)
  Bottom Layer w0.3: v1(40.4,52) 40.4,54.9 Board1.20
  vias: v1(50.7,31.55) v1(50.7,31.05) v1(50.7,30.55) v1(50.7,30.05) v1(50.7,29.55) v1(50.7,29.05) v1(50.7,28.55) v1(50.7,28.05) v1(50.7,27.55) v1(50.7,27.05) v1(50.7,26.55) v1(50.7,26.05) v1(50.7,25.55) v1(51.2,32.05) v1(51.2,31.55) v1(51.2,31.05) v1(51.2,30.55) v1(51.2,30.05) v1(51.2,29.55) v1(51.2,29.05) v1(51.2,28.55) v1(51.2,28.05) v1(51.2,27.55) v1(51.2,27.05) v1(51.2,26.55) v1(51.2,26.05) v1(51.2,25.55) v1(51.2,25.05) v1(51.7,32.05) v1(51.7,31.55) v1(51.7,31.05) v1(51.7,30.55) v1(51.7,30.05) v1(51.7,29.55) v1(51.7,29.05) v1(51.7,28.55) v1(51.7,28.05) v1(51.7,27.55) v1(51.7,27.05) v1(51.7,26.55) v1(51.7,26.05) v1(51.7,25.55) v1(51.7,25.05) v1(51.7,24.55) v1(52.2,32.05) v1(52.2,31.55) v1(52.2,31.05) v1(52.2,30.55) v1(52.2,30.05) v1(52.2,29.55) v1(52.2,29.05) v1(52.2,28.55) v1(52.2,28.05) v1(52.2,27.55) v1(52.2,27.05) v1(52.2,26.55) v1(52.2,26.05) v1(52.2,25.55) v1(52.2,25.05) v1(52.2,24.55) v1(52.7,32.05) v1(52.7,31.55) v1(52.7,31.05) v1(52.7,30.55) v1(52.7,30.05) v1(52.7,29.55) v1(52.7,29.05) v1(52.7,28.55) v1(52.7,28.05) v1(52.7,27.55) v1(52.7,27.05) v1(52.7,26.55) v1(52.7,26.05) v1(52.7,25.55) v1(52.7,25.05) v1(52.7,24.55) v1(53.2,32.05) v1(53.2,31.55) v1(53.2,31.05) v1(53.2,30.55) v1(53.2,30.05) v1(53.2,29.55) v1(53.2,29.05) v1(53.2,28.55) v1(53.2,28.05) v1(53.2,27.55) v1(53.2,27.05) v1(53.2,26.55) v1(53.2,26.05) v1(53.2,25.55) v1(53.2,25.05) v1(53.2,24.55) v1(53.2,24.05) v1(53.2,23.55) v1(53.2,23.05) v1(53.7,32.05) v1(53.7,31.55) v1(53.7,31.05) v1(53.7,30.55) v1(53.7,30.05) v1(53.7,29.55) v1(53.7,29.05) v1(53.7,28.55) v1(53.7,28.05) v1(53.7,27.55) v1(53.7,27.05) v1(53.7,26.55) v1(53.7,26.05) v1(53.7,25.55) v1(53.7,25.05) v1(53.7,24.55) v1(53.7,24.05) v1(53.7,23.55) v1(53.7,23.05) v1(54.2,32.05) v1(54.2,31.55) v1(54.2,31.05) v1(54.2,30.55) v1(54.2,30.05) v1(54.2,29.55) v1(54.2,29.05) v1(54.2,28.55) v1(54.2,28.05) v1(54.2,27.55) v1(54.2,27.05) v1(54.2,26.55) v1(54.2,26.05) v1(54.2,25.55) v1(54.2,25.05) v1(54.2,24.55) v1(54.2,24.05) v1(54.2,23.55) v1(54.2,23.05) v1(54.7,32.05) v1(54.7,31.55) v1(54.7,31.05) v1(54.7,30.55) v1(54.7,30.05) v1(54.7,29.55) v1(54.7,29.05) v1(54.7,28.55) v1(54.7,28.05) v1(54.7,27.55) v1(54.7,27.05) v1(54.7,26.55) v1(54.7,26.05) v1(54.7,25.55) v1(54.7,25.05) v1(54.7,24.55) v1(54.7,24.05) v1(54.7,23.55) v1(54.7,23.05) v1(55.2,32.05) v1(55.2,31.55) v1(55.2,31.05) v1(55.2,30.55) v1(55.2,30.05) v1(55.2,29.55) v1(55.2,29.05) v1(55.2,28.55) v1(55.2,28.05) v1(55.2,27.55) v1(55.2,27.05) v1(55.2,26.55) v1(55.2,26.05) v1(55.2,25.55) v1(55.2,25.05) v1(55.2,24.55) v1(55.2,24.05) v1(55.2,23.55) v1(55.2,23.05) v1(55.7,32.05) v1(55.7,31.55) v1(55.7,31.05) v1(55.7,30.55) v1(55.7,30.05) v1(55.7,29.55) v1(55.7,29.05) v1(55.7,28.55) v1(55.7,28.05) v1(55.7,27.55) v1(55.7,27.05) v1(55.7,26.55) v1(55.7,26.05) v1(55.7,25.55) v1(55.7,25.05) v1(55.7,24.55) v1(55.7,24.05) v1(55.7,23.55) v1(55.7,23.05) v1(56.2,32.05) v1(56.2,31.55) v1(56.2,31.05) v1(56.2,30.55) v1(56.2,30.05) v1(56.2,29.55) v1(56.2,29.05) v1(56.2,28.55) v1(56.2,28.05) v1(56.2,27.55) v1(56.2,27.05) v1(56.2,26.55) v1(56.2,26.05) v1(56.2,25.55) v1(56.2,25.05) v1(56.2,24.55) v1(56.2,24.05) v1(56.2,23.55) v1(56.2,23.05) v1(56.7,32.05) v1(56.7,31.55) v1(56.7,31.05) v1(56.7,30.55) v1(56.7,30.05) v1(56.7,29.55) v1(56.7,29.05) v1(56.7,28.55) v1(56.7,28.05) v1(56.7,27.55) v1(56.7,27.05) v1(56.7,26.55) v1(56.7,26.05) v1(56.7,25.55) v1(56.7,25.05) v1(56.7,24.55) v1(56.7,24.05) v1(56.7,23.55) v1(56.7,23.05) v1(57.2,32.05) v1(57.2,31.55) v1(57.2,31.05) v1(57.2,30.55) v1(57.2,30.05) v1(57.2,29.55) v1(57.2,29.05) v1(57.2,28.55) v1(57.2,28.05) v1(57.2,27.55) v1(57.2,27.05) v1(57.2,26.55) v1(57.2,26.05) v1(57.2,25.55) v1(57.2,25.05) v1(57.2,24.55) v1(57.2,24.05) v1(57.2,23.55) v1(57.2,23.05) v1(57.7,32.05) v1(57.7,31.55) v1(57.7,31.05) v1(57.7,30.55) v1(57.7,30.05) v1(57.7,29.55) v1(57.7,29.05) v1(57.7,28.55) v1(57.7,28.05) v1(57.7,27.55) v1(57.7,27.05) v1(57.7,26.55) v1(57.7,26.05) v1(57.7,25.55) v1(57.7,25.05) v1(57.7,24.55) v1(57.7,24.05) v1(57.7,23.55) v1(57.7,23.05) v1(58.2,32.05) v1(58.2,31.55) v1(58.2,31.05) v1(58.2,30.55) v1(58.2,30.05) v1(58.2,29.55) v1(58.2,29.05) v1(58.2,28.55) v1(58.2,28.05) v1(58.2,27.55) v1(58.2,27.05) v1(58.2,26.55) v1(58.2,26.05) v1(58.2,25.55) v1(58.2,25.05) v1(58.2,24.55) v1(58.2,24.05) v1(58.2,23.55) v1(58.2,23.05) v1(58.7,32.05) v1(58.7,31.55) v1(58.7,31.05) v1(58.7,30.55) v1(58.7,30.05) v1(58.7,29.55) v1(58.7,29.05) v1(58.7,28.55) v1(58.7,28.05) v1(58.7,27.55) v1(58.7,27.05) v1(58.7,26.55) v1(58.7,26.05) v1(58.7,25.55) v1(58.7,25.05) v1(58.7,24.55) v1(58.7,24.05) v1(58.7,23.55) v1(58.7,23.05)
M1OUTV: length 53.5
  信号层 w0.3: v1(52.1,21.3) 51.5,21.3 39.8,33 39.8,53 42.6,55.8 v1(42.6,63.2)
  Bottom Layer w0.3: v1(42.6,63.2) 42.6,61.2 40.9,59.5 Board1.17
  vias: v1(50.7,19.5) v1(50.7,19) v1(50.7,18.5) v1(50.7,18) v1(50.7,17.5) v1(50.7,17) v1(50.7,16.5) v1(50.7,16) v1(50.7,15.5) v1(50.7,15) v1(50.7,14.5) v1(50.7,14) v1(50.7,13.5) v1(50.7,13) v1(50.7,12.5) v1(50.7,12) v1(51.2,19.5) v1(51.2,19) v1(51.2,18.5) v1(51.2,18) v1(51.2,17.5) v1(51.2,17) v1(51.2,16.5) v1(51.2,16) v1(51.2,15.5) v1(51.2,15) v1(51.2,14.5) v1(51.2,14) v1(51.2,13.5) v1(51.2,13) v1(51.2,12.5) v1(51.2,12) v1(51.7,19.5) v1(51.7,19) v1(51.7,18.5) v1(51.7,18) v1(51.7,17.5) v1(51.7,17) v1(51.7,16.5) v1(51.7,16) v1(51.7,15.5) v1(51.7,15) v1(51.7,14.5) v1(51.7,14) v1(51.7,13.5) v1(51.7,13) v1(51.7,12.5) v1(51.7,12) v1(52.2,19.5) v1(52.2,19) v1(52.2,18.5) v1(52.2,18) v1(52.2,17.5) v1(52.2,17) v1(52.2,16.5) v1(52.2,16) v1(52.2,15.5) v1(52.2,15) v1(52.2,14.5) v1(52.2,14) v1(52.2,13.5) v1(52.2,13) v1(52.2,12.5) v1(52.2,12) v1(52.7,19.5) v1(52.7,19) v1(52.7,18.5) v1(52.7,18) v1(52.7,17.5) v1(52.7,17) v1(52.7,16.5) v1(52.7,16) v1(52.7,15.5) v1(52.7,15) v1(52.7,14.5) v1(52.7,14) v1(52.7,13.5) v1(52.7,13) v1(52.7,12.5) v1(52.7,12) v1(53.2,19.5) v1(53.2,19) v1(53.2,18.5) v1(53.2,18) v1(53.2,17.5) v1(53.2,17) v1(53.2,16.5) v1(53.2,16) v1(53.2,15.5) v1(53.2,15) v1(53.2,14.5) v1(53.2,14) v1(53.2,13.5) v1(53.2,13) v1(53.2,12.5) v1(53.2,12) v1(53.2,11.5) v1(53.2,11) v1(53.2,10.5) v1(53.7,19.5) v1(53.7,19) v1(53.7,18.5) v1(53.7,18) v1(53.7,17.5) v1(53.7,17) v1(53.7,16.5) v1(53.7,16) v1(53.7,15.5) v1(53.7,15) v1(53.7,14.5) v1(53.7,14) v1(53.7,13.5) v1(53.7,13) v1(53.7,12.5) v1(53.7,12) v1(53.7,11.5) v1(53.7,11) v1(53.7,10.5) v1(54.2,19.5) v1(54.2,19) v1(54.2,18.5) v1(54.2,18) v1(54.2,17.5) v1(54.2,17) v1(54.2,16.5) v1(54.2,16) v1(54.2,15.5) v1(54.2,15) v1(54.2,14.5) v1(54.2,14) v1(54.2,13.5) v1(54.2,13) v1(54.2,12.5) v1(54.2,12) v1(54.2,11.5) v1(54.2,11) v1(54.2,10.5) v1(54.7,19.5) v1(54.7,19) v1(54.7,18.5) v1(54.7,18) v1(54.7,17.5) v1(54.7,17) v1(54.7,16.5) v1(54.7,16) v1(54.7,15.5) v1(54.7,15) v1(54.7,14.5) v1(54.7,14) v1(54.7,13.5) v1(54.7,13) v1(54.7,12.5) v1(54.7,12) v1(54.7,11.5) v1(54.7,11) v1(54.7,10.5) v1(55.2,19.5) v1(55.2,19) v1(55.2,18.5) v1(55.2,18) v1(55.2,17.5) v1(55.2,17) v1(55.2,16.5) v1(55.2,16) v1(55.2,15.5) v1(55.2,15) v1(55.2,14.5) v1(55.2,14) v1(55.2,13.5) v1(55.2,13) v1(55.2,12.5) v1(55.2,12) v1(55.2,11.5) v1(55.2,11) v1(55.2,10.5) v1(55.7,19.5) v1(55.7,19) v1(55.7,18.5) v1(55.7,18) v1(55.7,17.5) v1(55.7,17) v1(55.7,16.5) v1(55.7,16) v1(55.7,15.5) v1(55.7,15) v1(55.7,14.5) v1(55.7,14) v1(55.7,13.5) v1(55.7,13) v1(55.7,12.5) v1(55.7,12) v1(55.7,11.5) v1(55.7,11) v1(55.7,10.5) v1(56.2,19.5) v1(56.2,19) v1(56.2,18.5) v1(56.2,18) v1(56.2,17.5) v1(56.2,17) v1(56.2,16.5) v1(56.2,16) v1(56.2,15.5) v1(56.2,15) v1(56.2,14.5) v1(56.2,14) v1(56.2,13.5) v1(56.2,13) v1(56.2,12.5) v1(56.2,12) v1(56.2,11.5) v1(56.2,11) v1(56.2,10.5) v1(56.7,19.5) v1(56.7,19) v1(56.7,18.5) v1(56.7,18) v1(56.7,17.5) v1(56.7,17) v1(56.7,16.5) v1(56.7,16) v1(56.7,15.5) v1(56.7,15) v1(56.7,14.5) v1(56.7,14) v1(56.7,13.5) v1(56.7,13) v1(56.7,12.5) v1(56.7,12) v1(56.7,11.5) v1(56.7,11) v1(56.7,10.5) v1(57.2,19.5) v1(57.2,19) v1(57.2,18.5) v1(57.2,18) v1(57.2,17.5) v1(57.2,17) v1(57.2,16.5) v1(57.2,16) v1(57.2,15.5) v1(57.2,15) v1(57.2,14.5) v1(57.2,14) v1(57.2,13.5) v1(57.2,13) v1(57.2,12.5) v1(57.2,12) v1(57.2,11.5) v1(57.2,11) v1(57.2,10.5) v1(57.7,19.5) v1(57.7,19) v1(57.7,18.5) v1(57.7,18) v1(57.7,17.5) v1(57.7,17) v1(57.7,16.5) v1(57.7,16) v1(57.7,15.5) v1(57.7,15) v1(57.7,14.5) v1(57.7,14) v1(57.7,13.5) v1(57.7,13) v1(57.7,12.5) v1(57.7,12) v1(57.7,11.5) v1(57.7,11) v1(57.7,10.5) v1(58.2,19.5) v1(58.2,19) v1(58.2,18.5) v1(58.2,18) v1(58.2,17.5) v1(58.2,17) v1(58.2,16.5) v1(58.2,16) v1(58.2,15.5) v1(58.2,15) v1(58.2,14.5) v1(58.2,14) v1(58.2,13.5) v1(58.2,13) v1(58.2,12.5) v1(58.2,12) v1(58.2,11.5) v1(58.2,11) v1(58.2,10.5) v1(58.7,19.5) v1(58.7,19) v1(58.7,18.5) v1(58.7,18) v1(58.7,17.5) v1(58.7,17) v1(58.7,16.5) v1(58.7,16) v1(58.7,15.5) v1(58.7,15) v1(58.7,14.5) v1(58.7,14) v1(58.7,13.5) v1(58.7,13) v1(58.7,12.5) v1(58.7,12) v1(58.7,11.5) v1(58.7,11) v1(58.7,10.5)
M1OUTW: length 41.6
  信号层 w0.3: v1(50.9,38.8) 49.7,38.8 48.2,40.3 48.2,59.9 40.2,67.9 38.8,67.9 38.1,67.2 38.1,64.8 v1(38.9,64)
  Bottom Layer w0.3: Board1.14 v1(38.9,64)
  vias: v1(50.7,49.15) v1(50.7,48.65) v1(50.7,48.15) v1(50.7,47.65) v1(50.7,47.15) v1(50.7,46.65) v1(50.7,46.15) v1(50.7,45.65) v1(50.7,45.15) v1(50.7,44.65) v1(50.7,44.15) v1(50.7,43.65) v1(50.7,43.15) v1(50.7,42.65) v1(50.7,42.15) v1(50.7,41.65) v1(51.2,49.15) v1(51.2,48.65) v1(51.2,48.15) v1(51.2,47.65) v1(51.2,47.15) v1(51.2,46.65) v1(51.2,46.15) v1(51.2,45.65) v1(51.2,45.15) v1(51.2,44.65) v1(51.2,44.15) v1(51.2,43.65) v1(51.2,43.15) v1(51.2,42.65) v1(51.2,42.15) v1(51.2,41.65) v1(51.7,49.15) v1(51.7,48.65) v1(51.7,48.15) v1(51.7,47.65) v1(51.7,47.15) v1(51.7,46.65) v1(51.7,46.15) v1(51.7,45.65) v1(51.7,45.15) v1(51.7,44.65) v1(51.7,44.15) v1(51.7,43.65) v1(51.7,43.15) v1(51.7,42.65) v1(51.7,42.15) v1(51.7,41.65) v1(52.2,49.15) v1(52.2,48.65) v1(52.2,48.15) v1(52.2,47.65) v1(52.2,47.15) v1(52.2,46.65) v1(52.2,46.15) v1(52.2,45.65) v1(52.2,45.15) v1(52.2,44.65) v1(52.2,44.15) v1(52.2,43.65) v1(52.2,43.15) v1(52.2,42.65) v1(52.2,42.15) v1(52.2,41.65) v1(52.7,49.15) v1(52.7,48.65) v1(52.7,48.15) v1(52.7,47.65) v1(52.7,47.15) v1(52.7,46.65) v1(52.7,46.15) v1(52.7,45.65) v1(52.7,45.15) v1(52.7,44.65) v1(52.7,44.15) v1(52.7,43.65) v1(52.7,43.15) v1(52.7,42.65) v1(52.7,42.15) v1(52.7,41.65) v1(53.2,49.15) v1(53.2,48.65) v1(53.2,48.15) v1(53.2,47.65) v1(53.2,47.15) v1(53.2,46.65) v1(53.2,46.15) v1(53.2,45.65) v1(53.2,45.15) v1(53.2,44.65) v1(53.2,44.15) v1(53.2,43.65) v1(53.2,43.15) v1(53.2,42.65) v1(53.2,42.15) v1(53.2,41.65) v1(53.2,41.15) v1(53.2,40.65) v1(53.2,40.15) v1(53.7,49.15) v1(53.7,48.65) v1(53.7,48.15) v1(53.7,47.65) v1(53.7,47.15) v1(53.7,46.65) v1(53.7,46.15) v1(53.7,45.65) v1(53.7,45.15) v1(53.7,44.65) v1(53.7,44.15) v1(53.7,43.65) v1(53.7,43.15) v1(53.7,42.65) v1(53.7,42.15) v1(53.7,41.65) v1(53.7,41.15) v1(53.7,40.65) v1(53.7,40.15) v1(54.2,49.15) v1(54.2,48.65) v1(54.2,48.15) v1(54.2,47.65) v1(54.2,47.15) v1(54.2,46.65) v1(54.2,46.15) v1(54.2,45.65) v1(54.2,45.15) v1(54.2,44.65) v1(54.2,44.15) v1(54.2,43.65) v1(54.2,43.15) v1(54.2,42.65) v1(54.2,42.15) v1(54.2,41.65) v1(54.2,41.15) v1(54.2,40.65) v1(54.2,40.15) v1(54.7,49.15) v1(54.7,48.65) v1(54.7,48.15) v1(54.7,47.65) v1(54.7,47.15) v1(54.7,46.65) v1(54.7,46.15) v1(54.7,45.65) v1(54.7,45.15) v1(54.7,44.65) v1(54.7,44.15) v1(54.7,43.65) v1(54.7,43.15) v1(54.7,42.65) v1(54.7,42.15) v1(54.7,41.65) v1(54.7,41.15) v1(54.7,40.65) v1(54.7,40.15) v1(55.2,49.15) v1(55.2,48.65) v1(55.2,48.15) v1(55.2,47.65) v1(55.2,47.15) v1(55.2,46.65) v1(55.2,46.15) v1(55.2,45.65) v1(55.2,45.15) v1(55.2,44.65) v1(55.2,44.15) v1(55.2,43.65) v1(55.2,43.15) v1(55.2,42.65) v1(55.2,42.15) v1(55.2,41.65) v1(55.2,41.15) v1(55.2,40.65) v1(55.2,40.15) v1(55.7,49.15) v1(55.7,48.65) v1(55.7,48.15) v1(55.7,47.65) v1(55.7,47.15) v1(55.7,46.65) v1(55.7,46.15) v1(55.7,45.65) v1(55.7,45.15) v1(55.7,44.65) v1(55.7,44.15) v1(55.7,43.65) v1(55.7,43.15) v1(55.7,42.65) v1(55.7,42.15) v1(55.7,41.65) v1(55.7,41.15) v1(55.7,40.65) v1(55.7,40.15) v1(56.2,49.15) v1(56.2,48.65) v1(56.2,48.15) v1(56.2,47.65) v1(56.2,47.15) v1(56.2,46.65) v1(56.2,46.15) v1(56.2,45.65) v1(56.2,45.15) v1(56.2,44.65) v1(56.2,44.15) v1(56.2,43.65) v1(56.2,43.15) v1(56.2,42.65) v1(56.2,42.15) v1(56.2,41.65) v1(56.2,41.15) v1(56.2,40.65) v1(56.2,40.15) v1(56.7,49.15) v1(56.7,48.65) v1(56.7,48.15) v1(56.7,47.65) v1(56.7,47.15) v1(56.7,46.65) v1(56.7,46.15) v1(56.7,45.65) v1(56.7,45.15) v1(56.7,44.65) v1(56.7,44.15) v1(56.7,43.65) v1(56.7,43.15) v1(56.7,42.65) v1(56.7,42.15) v1(56.7,41.65) v1(56.7,41.15) v1(56.7,40.65) v1(56.7,40.15) v1(57.2,49.15) v1(57.2,48.65) v1(57.2,48.15) v1(57.2,47.65) v1(57.2,47.15) v1(57.2,46.65) v1(57.2,46.15) v1(57.2,45.65) v1(57.2,45.15) v1(57.2,44.65) v1(57.2,44.15) v1(57.2,43.65) v1(57.2,43.15) v1(57.2,42.65) v1(57.2,42.15) v1(57.2,41.65) v1(57.2,41.15) v1(57.2,40.65) v1(57.2,40.15) v1(57.7,49.15) v1(57.7,48.65) v1(57.7,48.15) v1(57.7,47.65) v1(57.7,47.15) v1(57.7,46.65) v1(57.7,46.15) v1(57.7,45.65) v1(57.7,45.15) v1(57.7,44.65) v1(57.7,44.15) v1(57.7,43.65) v1(57.7,43.15) v1(57.7,42.65) v1(57.7,42.15) v1(57.7,41.65) v1(57.7,41.15) v1(57.7,40.65) v1(57.7,40.15) v1(58.2,49.15) v1(58.2,48.65) v1(58.2,48.15) v1(58.2,47.65) v1(58.2,47.15) v1(58.2,46.65) v1(58.2,46.15) v1(58.2,45.65) v1(58.2,45.15) v1(58.2,44.65) v1(58.2,44.15) v1(58.2,43.65) v1(58.2,43.15) v1(58.2,42.65) v1(58.2,42.15) v1(58.2,41.65) v1(58.2,41.15) v1(58.2,40.65) v1(58.2,40.15) v1(58.7,49.15) v1(58.7,48.65) v1(58.7,48.15) v1(58.7,47.65) v1(58.7,47.15) v1(58.7,46.65) v1(58.7,46.15) v1(58.7,45.65) v1(58.7,45.15) v1(58.7,44.65) v1(58.7,44.15) v1(58.7,43.65) v1(58.7,43.15) v1(58.7,42.65) v1(58.7,42.15) v1(58.7,41.65) v1(58.7,41.15) v1(58.7,40.65) v1(58.7,40.15)
M2GHU: length 30.4
  Top Layer w0.3: Q7.1 50.08,53.27 49.65,53.7 49.65,62.5 50,62.85 50,64.35 v1(50.9,65.25)
  信号层 w0.3: v1(42.2,69.2) 42.2,69 42.6,68.6 43,68.6 43.8,69.4 46.5,69.4 48.3,67.6 48.3,65.25 48.85,64.7 50.35,64.7 v1(50.9,65.25)
  Bottom Layer w0.3: Board1.9 41,71.5 42.2,70.3 v1(42.2,69.2)
M2GHV: length 25.8
  Top Layer w0.3: Q8.1 50.98,70.37 50.9,70.3 v1(50.9,68.45)
  信号层 w0.3: v1(50.9,68.45) 49.1,70.25 49.1,76.6 44.9,80.8 v1(42.5,80.8)
  Bottom Layer w0.3: Board1.6 41.1,76 41.9,76.8 41.9,80.31 42.39,80.8 v1(42.5,80.8)
M2GHW: length 18.5
  Top Layer w0.3: Q9.1 50.77,82.87 50.6,82.7 v1(50.6,80.9)
  信号层 w0.3: v1(50.6,80.9) 50,80.3 47.79,80.3 47.4,80.69 47.4,81.8 46.5,82.7 41.1,82.7 39.2,80.8 v1(38.9,80.8)
  Bottom Layer w0.3: Board1.3 39.62,80.5 39.32,80.8 v1(38.9,80.8)
M2GLU: length 29.3
  Top Layer w0.3: v1(49.1,65.25) 48.75,65.25 48.2,64.7 48.2,63.25 49.1,62.35 49.1,53.6 v1(48.8,53.3)
  信号层 w0.3: v1(42.8,69.2) 43.45,69.85 46.69,69.85 48.8,67.74 48.8,65.55 v1(49.1,65.25)
  Bottom Layer w0.3: Board1.8 40.8,73 42.8,71 v1(42.8,69.2) ; Q10.1 47.48,53.3 v1(48.8,53.3)
M2GLV: length 25.4
  Top Layer w0.3: R11.2 48.4,69.15 v1(48.1,69.15)
  信号层 w0.3: v1(48.1,69.15) 48.1,76.15 44.8,79.45 42.4,79.45 41.75,80.1 41.75,80.95 42.2,81.4 v1(42.5,81.4)
  Bottom Layer w0.3: Q11.1 47.92,70.37 48.1,70.2 v1(48.1,69.15) ; Board1.5 40.7,77.5 41.3,78.1 41.3,81.1 41.6,81.4 v1(42.5,81.4)
M2GLW: length 15.6
  信号层 w0.3: v1(38.9,81.4) 40.7,83.2 46.7,83.2 47.9,82 v1(47.9,80.9)
  Bottom Layer w0.3: v1(38.9,81.4) 38.9,81.7 39.2,82 Board1.2 ; v1(47.9,80.9) 47.9,82.87 Q12.1
M2OUTU: length 15.8
  信号层 w0.3: v1(41.6,69.2) 41.6,68.9 42.35,68.15 43.2,68.15 44,68.95 46.3,68.95 47.8,67.45 47.8,64.95 48.6,64.15 50.45,64.15 v1(50.9,63.7)
  Bottom Layer w0.3: Board1.10 41.3,70 41.6,69.7 v1(41.6,69.2)
  vias: v1(50.7,62) v1(50.7,61.5) v1(50.7,61) v1(50.7,60.5) v1(50.7,60) v1(50.7,59.5) v1(50.7,59) v1(50.7,58.5) v1(50.7,58) v1(50.7,57.5) v1(50.7,57) v1(50.7,56.5) v1(50.7,56) v1(50.7,55.5) v1(50.7,55) v1(50.7,54.5) v1(51.2,62) v1(51.2,61.5) v1(51.2,61) v1(51.2,60.5) v1(51.2,60) v1(51.2,59.5) v1(51.2,59) v1(51.2,58.5) v1(51.2,58) v1(51.2,57.5) v1(51.2,57) v1(51.2,56.5) v1(51.2,56) v1(51.2,55.5) v1(51.2,55) v1(51.2,54.5) v1(51.7,62) v1(51.7,61.5) v1(51.7,61) v1(51.7,60.5) v1(51.7,60) v1(51.7,59.5) v1(51.7,59) v1(51.7,58.5) v1(51.7,58) v1(51.7,57.5) v1(51.7,57) v1(51.7,56.5) v1(51.7,56) v1(51.7,55.5) v1(51.7,55) v1(51.7,54.5) v1(52.2,62) v1(52.2,61.5) v1(52.2,61) v1(52.2,60.5) v1(52.2,60) v1(52.2,59.5) v1(52.2,59) v1(52.2,58.5) v1(52.2,58) v1(52.2,57.5) v1(52.2,57) v1(52.2,56.5) v1(52.2,56) v1(52.2,55.5) v1(52.2,55) v1(52.2,54.5) v1(52.7,62) v1(52.7,61.5) v1(52.7,61) v1(52.7,60.5) v1(52.7,60) v1(52.7,59.5) v1(52.7,59) v1(52.7,58.5) v1(52.7,58) v1(52.7,57.5) v1(52.7,57) v1(52.7,56.5) v1(52.7,56) v1(52.7,55.5) v1(52.7,55) v1(52.7,54.5) v1(53.2,62) v1(53.2,61.5) v1(53.2,61) v1(53.2,60.5) v1(53.2,60) v1(53.2,59.5) v1(53.2,59) v1(53.2,58.5) v1(53.2,58) v1(53.2,57.5) v1(53.2,57) v1(53.2,56.5) v1(53.2,56) v1(53.2,55.5) v1(53.2,55) v1(53.2,54.5) v1(53.2,54) v1(53.2,53.5) v1(53.2,53) v1(53.7,62) v1(53.7,61.5) v1(53.7,61) v1(53.7,60.5) v1(53.7,60) v1(53.7,59.5) v1(53.7,59) v1(53.7,58.5) v1(53.7,58) v1(53.7,57.5) v1(53.7,57) v1(53.7,56.5) v1(53.7,56) v1(53.7,55.5) v1(53.7,55) v1(53.7,54.5) v1(53.7,54) v1(53.7,53.5) v1(53.7,53) v1(54.2,62) v1(54.2,61.5) v1(54.2,61) v1(54.2,60.5) v1(54.2,60) v1(54.2,59.5) v1(54.2,59) v1(54.2,58.5) v1(54.2,58) v1(54.2,57.5) v1(54.2,57) v1(54.2,56.5) v1(54.2,56) v1(54.2,55.5) v1(54.2,55) v1(54.2,54.5) v1(54.2,54) v1(54.2,53.5) v1(54.2,53) v1(54.7,62) v1(54.7,61.5) v1(54.7,61) v1(54.7,60.5) v1(54.7,60) v1(54.7,59.5) v1(54.7,59) v1(54.7,58.5) v1(54.7,58) v1(54.7,57.5) v1(54.7,57) v1(54.7,56.5) v1(54.7,56) v1(54.7,55.5) v1(54.7,55) v1(54.7,54.5) v1(54.7,54) v1(54.7,53.5) v1(54.7,53) v1(55.2,62) v1(55.2,61.5) v1(55.2,61) v1(55.2,60.5) v1(55.2,60) v1(55.2,59.5) v1(55.2,59) v1(55.2,58.5) v1(55.2,58) v1(55.2,57.5) v1(55.2,57) v1(55.2,56.5) v1(55.2,56) v1(55.2,55.5) v1(55.2,55) v1(55.2,54.5) v1(55.2,54) v1(55.2,53.5) v1(55.2,53) v1(55.7,62) v1(55.7,61.5) v1(55.7,61) v1(55.7,60.5) v1(55.7,60) v1(55.7,59.5) v1(55.7,59) v1(55.7,58.5) v1(55.7,58) v1(55.7,57.5) v1(55.7,57) v1(55.7,56.5) v1(55.7,56) v1(55.7,55.5) v1(55.7,55) v1(55.7,54.5) v1(55.7,54) v1(55.7,53.5) v1(55.7,53) v1(56.2,62) v1(56.2,61.5) v1(56.2,61) v1(56.2,60.5) v1(56.2,60) v1(56.2,59.5) v1(56.2,59) v1(56.2,58.5) v1(56.2,58) v1(56.2,57.5) v1(56.2,57) v1(56.2,56.5) v1(56.2,56) v1(56.2,55.5) v1(56.2,55) v1(56.2,54.5) v1(56.2,54) v1(56.2,53.5) v1(56.2,53) v1(56.7,62) v1(56.7,61.5) v1(56.7,61) v1(56.7,60.5) v1(56.7,60) v1(56.7,59.5) v1(56.7,59) v1(56.7,58.5) v1(56.7,58) v1(56.7,57.5) v1(56.7,57) v1(56.7,56.5) v1(56.7,56) v1(56.7,55.5) v1(56.7,55) v1(56.7,54.5) v1(56.7,54) v1(56.7,53.5) v1(56.7,53) v1(57.2,62) v1(57.2,61.5) v1(57.2,61) v1(57.2,60.5) v1(57.2,60) v1(57.2,59.5) v1(57.2,59) v1(57.2,58.5) v1(57.2,58) v1(57.2,57.5) v1(57.2,57) v1(57.2,56.5) v1(57.2,56) v1(57.2,55.5) v1(57.2,55) v1(57.2,54.5) v1(57.2,54) v1(57.2,53.5) v1(57.2,53) v1(57.7,62) v1(57.7,61.5) v1(57.7,61) v1(57.7,60.5) v1(57.7,60) v1(57.7,59.5) v1(57.7,59) v1(57.7,58.5) v1(57.7,58) v1(57.7,57.5) v1(57.7,57) v1(57.7,56.5) v1(57.7,56) v1(57.7,55.5) v1(57.7,55) v1(57.7,54.5) v1(57.7,54) v1(57.7,53.5) v1(57.7,53) v1(58.2,62) v1(58.2,61.5) v1(58.2,61) v1(58.2,60.5) v1(58.2,60) v1(58.2,59.5) v1(58.2,59) v1(58.2,58.5) v1(58.2,58) v1(58.2,57.5) v1(58.2,57) v1(58.2,56.5) v1(58.2,56) v1(58.2,55.5) v1(58.2,55) v1(58.2,54.5) v1(58.2,54) v1(58.2,53.5) v1(58.2,53) v1(58.7,62) v1(58.7,61.5) v1(58.7,61) v1(58.7,60.5) v1(58.7,60) v1(58.7,59.5) v1(58.7,59) v1(58.7,58.5) v1(58.7,58) v1(58.7,57.5) v1(58.7,57) v1(58.7,56.5) v1(58.7,56) v1(58.7,55.5) v1(58.7,55) v1(58.7,54.5) v1(58.7,54) v1(58.7,53.5) v1(58.7,53)
M2OUTV: length 27.6
  Top Layer w0.3: v1(50.9,66.95) 51.55,66.95 51.75,67.15 51.75,68.75
  信号层 w0.3: v1(50.9,66.95) 50.9,67.7 48.6,70 48.6,76.35 44.75,80.2 v1(42.5,80.2)
  Bottom Layer w0.3: Board1.7 41,74.5 42.5,76 v1(42.5,80.2)
  vias: v1(50.7,79.1) v1(50.7,78.6) v1(50.7,78.1) v1(50.7,77.6) v1(50.7,77.1) v1(50.7,76.6) v1(50.7,76.1) v1(50.7,75.6) v1(50.7,75.1) v1(50.7,74.6) v1(50.7,74.1) v1(50.7,73.6) v1(50.7,73.1) v1(50.7,72.6) v1(50.7,72.1) v1(50.7,71.6) v1(51.2,79.1) v1(51.2,78.6) v1(51.2,78.1) v1(51.2,77.6) v1(51.2,77.1) v1(51.2,76.6) v1(51.2,76.1) v1(51.2,75.6) v1(51.2,75.1) v1(51.2,74.6) v1(51.2,74.1) v1(51.2,73.6) v1(51.2,73.1) v1(51.2,72.6) v1(51.2,72.1) v1(51.2,71.6) v1(51.7,79.1) v1(51.7,78.6) v1(51.7,78.1) v1(51.7,77.6) v1(51.7,77.1) v1(51.7,76.6) v1(51.7,76.1) v1(51.7,75.6) v1(51.7,75.1) v1(51.7,74.6) v1(51.7,74.1) v1(51.7,73.6) v1(51.7,73.1) v1(51.7,72.6) v1(51.7,72.1) v1(51.7,71.6) v1(52.2,79.1) v1(52.2,78.6) v1(52.2,78.1) v1(52.2,77.6) v1(52.2,77.1) v1(52.2,76.6) v1(52.2,76.1) v1(52.2,75.6) v1(52.2,75.1) v1(52.2,74.6) v1(52.2,74.1) v1(52.2,73.6) v1(52.2,73.1) v1(52.2,72.6) v1(52.2,72.1) v1(52.2,71.6) v1(52.7,79.1) v1(52.7,78.6) v1(52.7,78.1) v1(52.7,77.6) v1(52.7,77.1) v1(52.7,76.6) v1(52.7,76.1) v1(52.7,75.6) v1(52.7,75.1) v1(52.7,74.6) v1(52.7,74.1) v1(52.7,73.6) v1(52.7,73.1) v1(52.7,72.6) v1(52.7,72.1) v1(52.7,71.6) v1(53.2,79.1) v1(53.2,78.6) v1(53.2,78.1) v1(53.2,77.6) v1(53.2,77.1) v1(53.2,76.6) v1(53.2,76.1) v1(53.2,75.6) v1(53.2,75.1) v1(53.2,74.6) v1(53.2,74.1) v1(53.2,73.6) v1(53.2,73.1) v1(53.2,72.6) v1(53.2,72.1) v1(53.2,71.6) v1(53.2,71.1) v1(53.2,70.6) v1(53.2,70.1) v1(53.7,79.1) v1(53.7,78.6) v1(53.7,78.1) v1(53.7,77.6) v1(53.7,77.1) v1(53.7,76.6) v1(53.7,76.1) v1(53.7,75.6) v1(53.7,75.1) v1(53.7,74.6) v1(53.7,74.1) v1(53.7,73.6) v1(53.7,73.1) v1(53.7,72.6) v1(53.7,72.1) v1(53.7,71.6) v1(53.7,71.1) v1(53.7,70.6) v1(53.7,70.1) v1(54.2,79.1) v1(54.2,78.6) v1(54.2,78.1) v1(54.2,77.6) v1(54.2,77.1) v1(54.2,76.6) v1(54.2,76.1) v1(54.2,75.6) v1(54.2,75.1) v1(54.2,74.6) v1(54.2,74.1) v1(54.2,73.6) v1(54.2,73.1) v1(54.2,72.6) v1(54.2,72.1) v1(54.2,71.6) v1(54.2,71.1) v1(54.2,70.6) v1(54.2,70.1) v1(54.7,79.1) v1(54.7,78.6) v1(54.7,78.1) v1(54.7,77.6) v1(54.7,77.1) v1(54.7,76.6) v1(54.7,76.1) v1(54.7,75.6) v1(54.7,75.1) v1(54.7,74.6) v1(54.7,74.1) v1(54.7,73.6) v1(54.7,73.1) v1(54.7,72.6) v1(54.7,72.1) v1(54.7,71.6) v1(54.7,71.1) v1(54.7,70.6) v1(54.7,70.1) v1(55.2,79.1) v1(55.2,78.6) v1(55.2,78.1) v1(55.2,77.6) v1(55.2,77.1) v1(55.2,76.6) v1(55.2,76.1) v1(55.2,75.6) v1(55.2,75.1) v1(55.2,74.6) v1(55.2,74.1) v1(55.2,73.6) v1(55.2,73.1) v1(55.2,72.6) v1(55.2,72.1) v1(55.2,71.6) v1(55.2,71.1) v1(55.2,70.6) v1(55.2,70.1) v1(55.7,79.1) v1(55.7,78.6) v1(55.7,78.1) v1(55.7,77.6) v1(55.7,77.1) v1(55.7,76.6) v1(55.7,76.1) v1(55.7,75.6) v1(55.7,75.1) v1(55.7,74.6) v1(55.7,74.1) v1(55.7,73.6) v1(55.7,73.1) v1(55.7,72.6) v1(55.7,72.1) v1(55.7,71.6) v1(55.7,71.1) v1(55.7,70.6) v1(55.7,70.1) v1(56.2,79.1) v1(56.2,78.6) v1(56.2,78.1) v1(56.2,77.6) v1(56.2,77.1) v1(56.2,76.6) v1(56.2,76.1) v1(56.2,75.6) v1(56.2,75.1) v1(56.2,74.6) v1(56.2,74.1) v1(56.2,73.6) v1(56.2,73.1) v1(56.2,72.6) v1(56.2,72.1) v1(56.2,71.6) v1(56.2,71.1) v1(56.2,70.6) v1(56.2,70.1) v1(56.7,79.1) v1(56.7,78.6) v1(56.7,78.1) v1(56.7,77.6) v1(56.7,77.1) v1(56.7,76.6) v1(56.7,76.1) v1(56.7,75.6) v1(56.7,75.1) v1(56.7,74.6) v1(56.7,74.1) v1(56.7,73.6) v1(56.7,73.1) v1(56.7,72.6) v1(56.7,72.1) v1(56.7,71.6) v1(56.7,71.1) v1(56.7,70.6) v1(56.7,70.1) v1(57.2,79.1) v1(57.2,78.6) v1(57.2,78.1) v1(57.2,77.6) v1(57.2,77.1) v1(57.2,76.6) v1(57.2,76.1) v1(57.2,75.6) v1(57.2,75.1) v1(57.2,74.6) v1(57.2,74.1) v1(57.2,73.6) v1(57.2,73.1) v1(57.2,72.6) v1(57.2,72.1) v1(57.2,71.6) v1(57.2,71.1) v1(57.2,70.6) v1(57.2,70.1) v1(57.7,79.1) v1(57.7,78.6) v1(57.7,78.1) v1(57.7,77.6) v1(57.7,77.1) v1(57.7,76.6) v1(57.7,76.1) v1(57.7,75.6) v1(57.7,75.1) v1(57.7,74.6) v1(57.7,74.1) v1(57.7,73.6) v1(57.7,73.1) v1(57.7,72.6) v1(57.7,72.1) v1(57.7,71.6) v1(57.7,71.1) v1(57.7,70.6) v1(57.7,70.1) v1(58.2,79.1) v1(58.2,78.6) v1(58.2,78.1) v1(58.2,77.6) v1(58.2,77.1) v1(58.2,76.6) v1(58.2,76.1) v1(58.2,75.6) v1(58.2,75.1) v1(58.2,74.6) v1(58.2,74.1) v1(58.2,73.6) v1(58.2,73.1) v1(58.2,72.6) v1(58.2,72.1) v1(58.2,71.6) v1(58.2,71.1) v1(58.2,70.6) v1(58.2,70.1) v1(58.7,79.1) v1(58.7,78.6) v1(58.7,78.1) v1(58.7,77.6) v1(58.7,77.1) v1(58.7,76.6) v1(58.7,76.1) v1(58.7,75.6) v1(58.7,75.1) v1(58.7,74.6) v1(58.7,74.1) v1(58.7,73.6) v1(58.7,73.1) v1(58.7,72.6) v1(58.7,72.1) v1(58.7,71.6) v1(58.7,71.1) v1(58.7,70.6) v1(58.7,70.1)
